# EAGLE design PCB - BOARD (EAGLE 9.2.2)

## Sheet 1 of 8: Connectors for module board
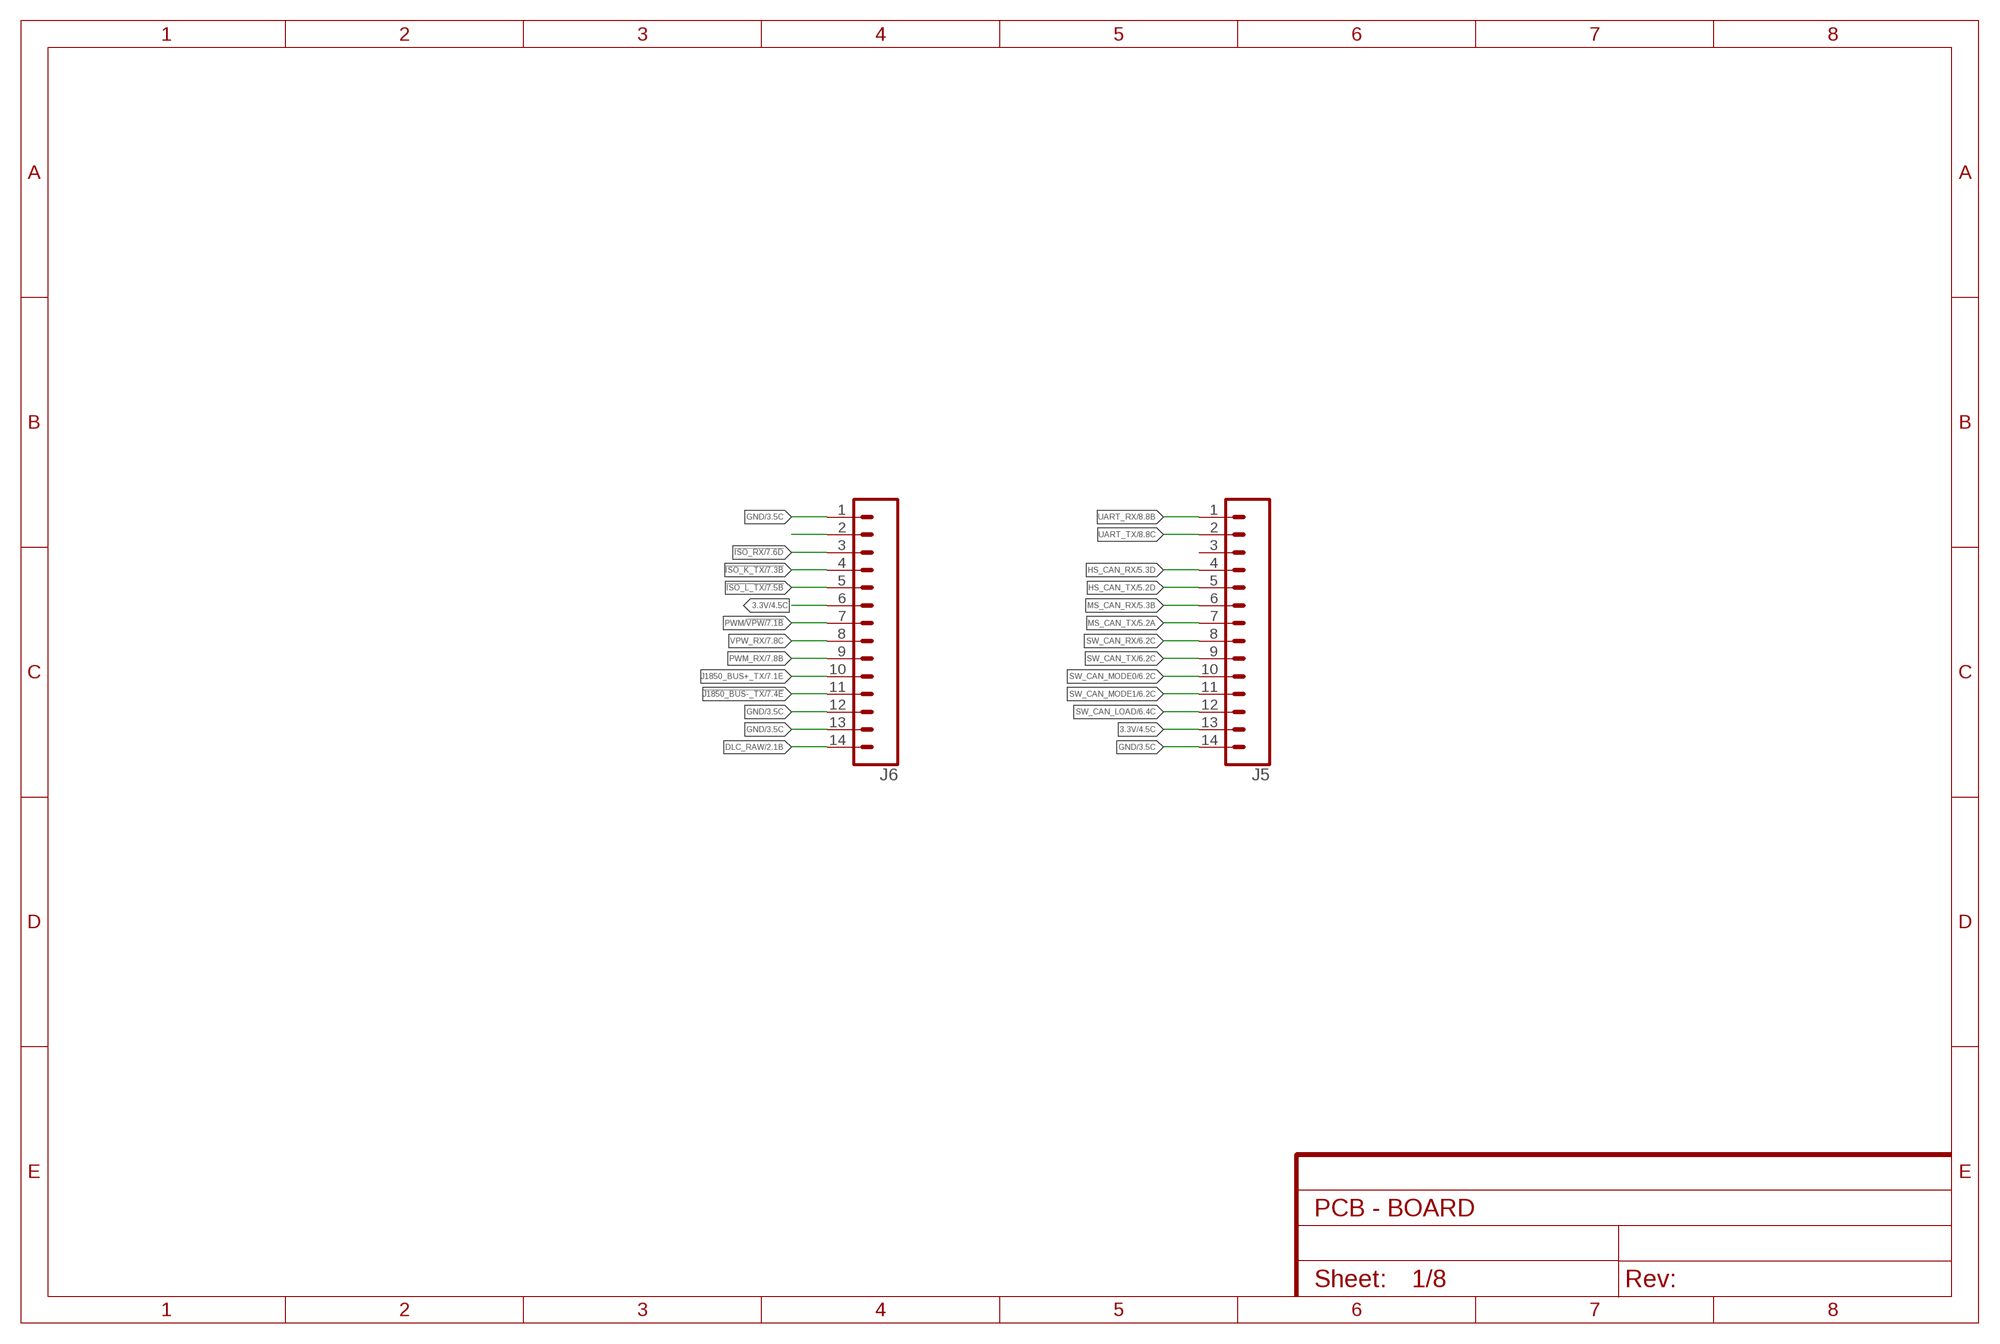
[diagram p0: schematic, sheet 1]

### Parts
J5  CONN_14  [1X14]
J6  CONN_14  [1X14]

### Nets
3.3V: J5.13 J6.6 ; also sheet 2,4,5,6,7
!ISO_K_TX: J6.4 ; also sheet 7
!ISO_L_TX: J6.5 ; also sheet 7
!ISO_RX: J6.3 ; also sheet 7
!J1850_BUS-_TX: J6.11 ; also sheet 7
DLC_RAW: J6.14 ; also sheet 2,3
GND: J5.14 J6.1 J6.2 J6.12 J6.13 ; also sheet 2,3,4,5,6,7,8
HS_CAN_RX: J5.4 ; also sheet 5
HS_CAN_TX: J5.5 ; also sheet 5
J1850_BUS+_TX: J6.10 ; also sheet 7
MS_CAN_RX: J5.6 ; also sheet 5
MS_CAN_TX: J5.7 ; also sheet 5
PWM/!VPW: J6.7 ; also sheet 7
PWM_RX: J6.9 ; also sheet 7
SW_CAN_LOAD: J5.12 ; also sheet 6
SW_CAN_MODE0: J5.10 ; also sheet 6
SW_CAN_MODE1: J5.11 ; also sheet 6
SW_CAN_RX: J5.8 ; also sheet 6
SW_CAN_TX: J5.9 ; also sheet 6
UART_RX: J5.1 ; also sheet 8
UART_TX: J5.2 ; also sheet 8
VPW_RX: J6.8 ; also sheet 7
Unconnected: J5.3

## Sheet 2 of 8: Power section
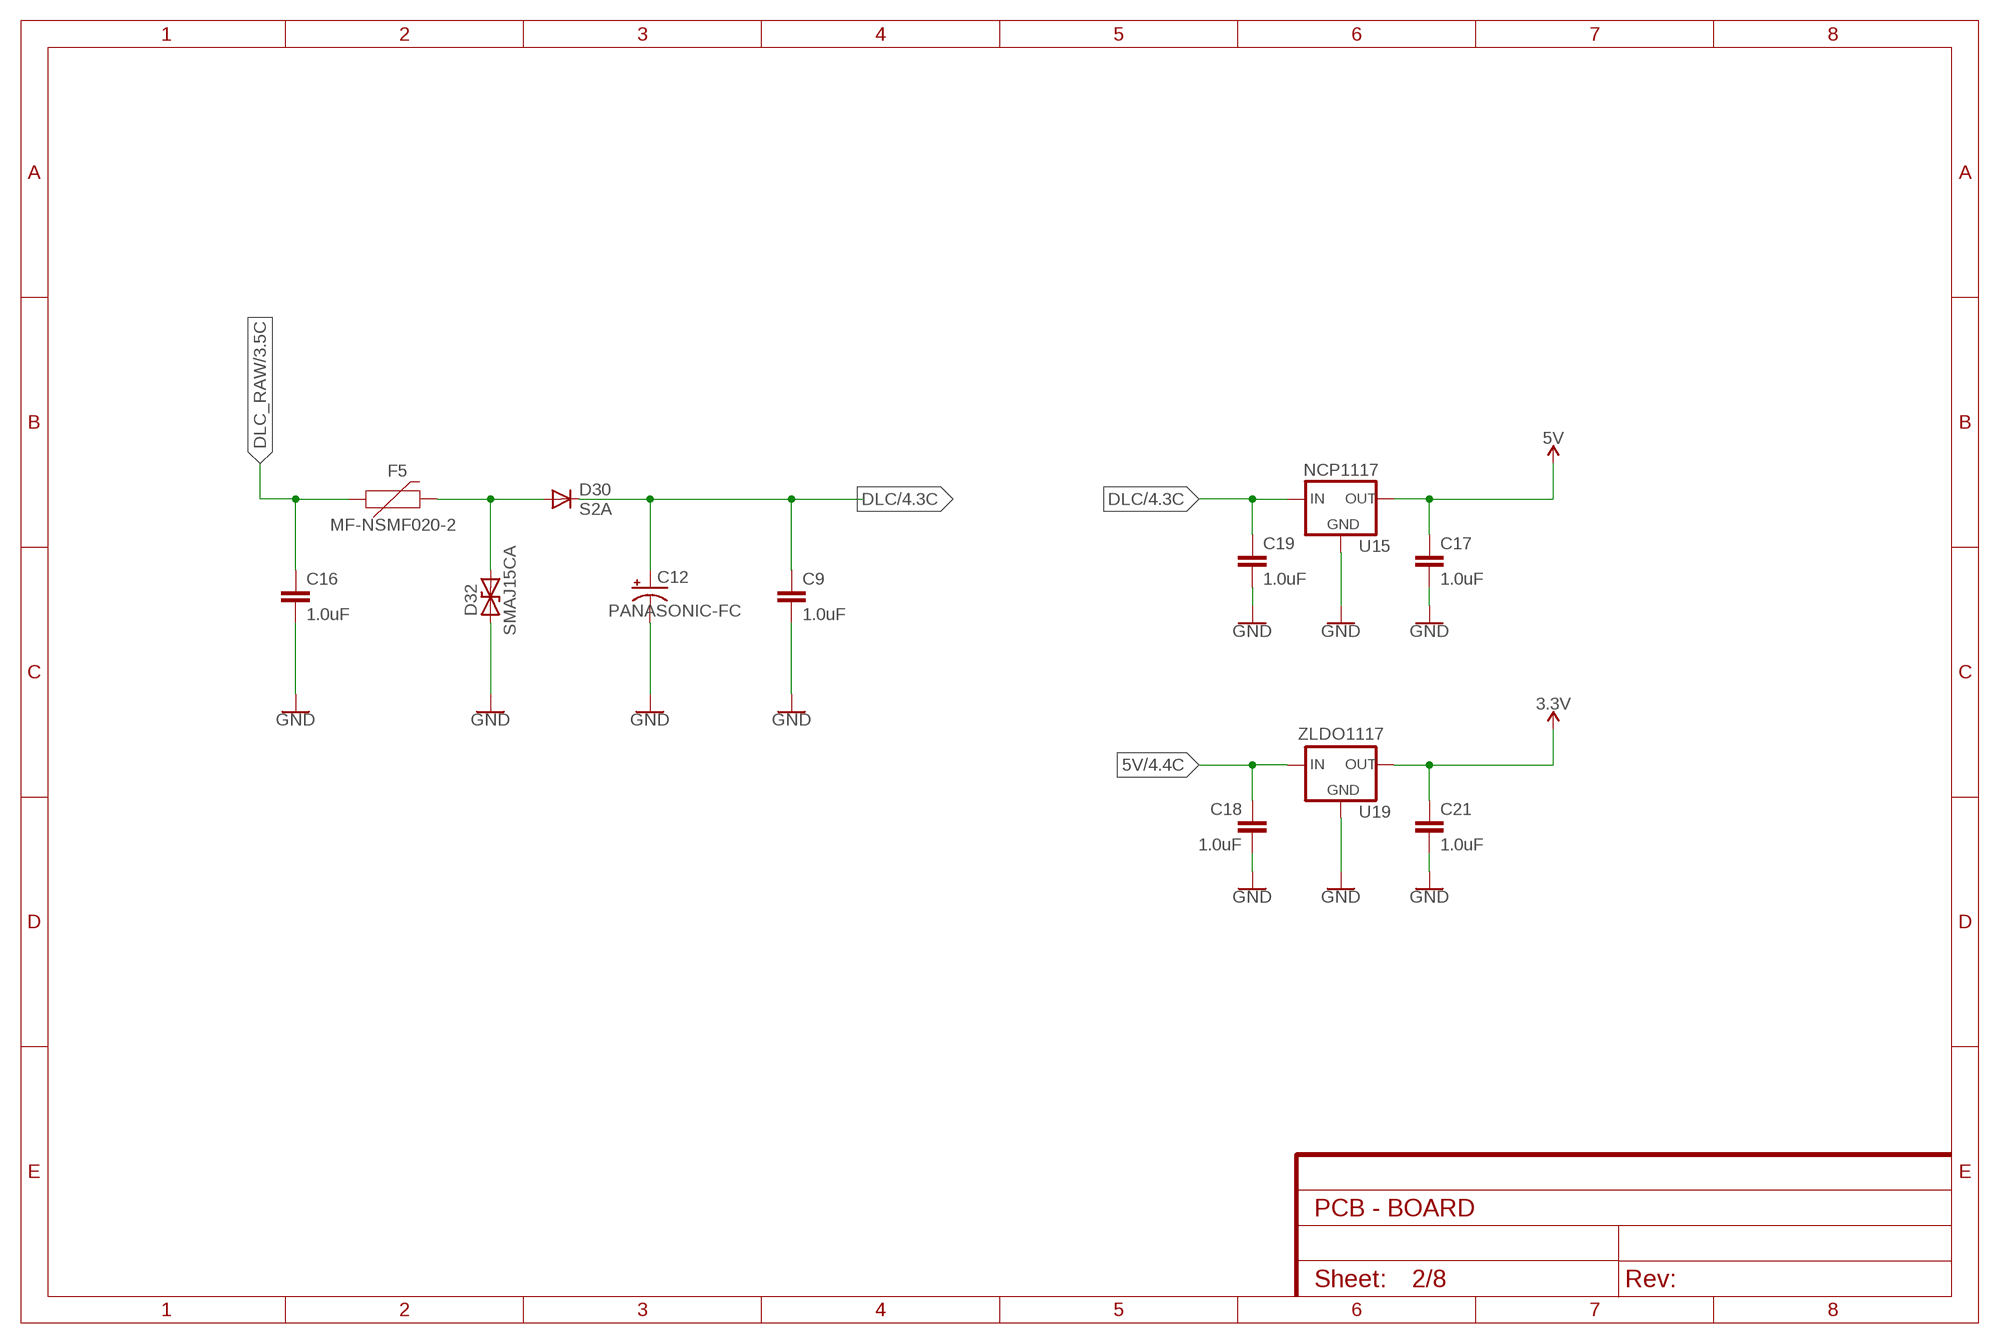
[diagram p1: schematic, sheet 2]

### Parts
C9  1.0uF  1.0UF-0805-25V-(+80/-20%)  [0805]
C12  PANASONIC-FC  [5X11]
C16  1.0uF  1.0UF-0805-25V-(+80/-20%)  [0805]
C17  1.0uF  1.0UF-0805-25V-(+80/-20%)  [0805]
C18  1.0uF  1.0UF-0805-25V-(+80/-20%)  [0805]
C19  1.0uF  1.0UF-0805-25V-(+80/-20%)  [0805]
C21  1.0uF  1.0UF-0805-25V-(+80/-20%)  [0805]
D30  S2A  [DO214AA]
D32  SMAJ15CA  [DO214AC]
F5  MF-NSMF020-2  PPTC_THREE-QUARTER-AMP  [1206]
U15  NCP1117  NCP1117DPAK  [TO-252]
U19  ZLDO1117  ZLDO1117SOT223  [SOT223]

### Nets
3.3V: C21.1 U19.2(OUT) U19.4(OUT) ; also sheet 1,4,5,6,7
5V: C17.1 C18.1 U15.2(OUT) U19.3(IN) ; also sheet 4,5,7
DLC: C9.1 C12.2(+) C19.1 D30.C U15.3(IN) ; also sheet 4,6,7
DLC_RAW: C16.1 F5.1 ; also sheet 1,3
DLC_RAW2: D30.A D32.C F5.2
GND: C9.2 C12.1(-) C16.2 C17.2 C18.2 C19.2 C21.2 D32.A U15.1(GND) U19.1(GND) ; also sheet 1,3,4,5,6,7,8

## Sheet 3 of 8: PCB and OBD connector
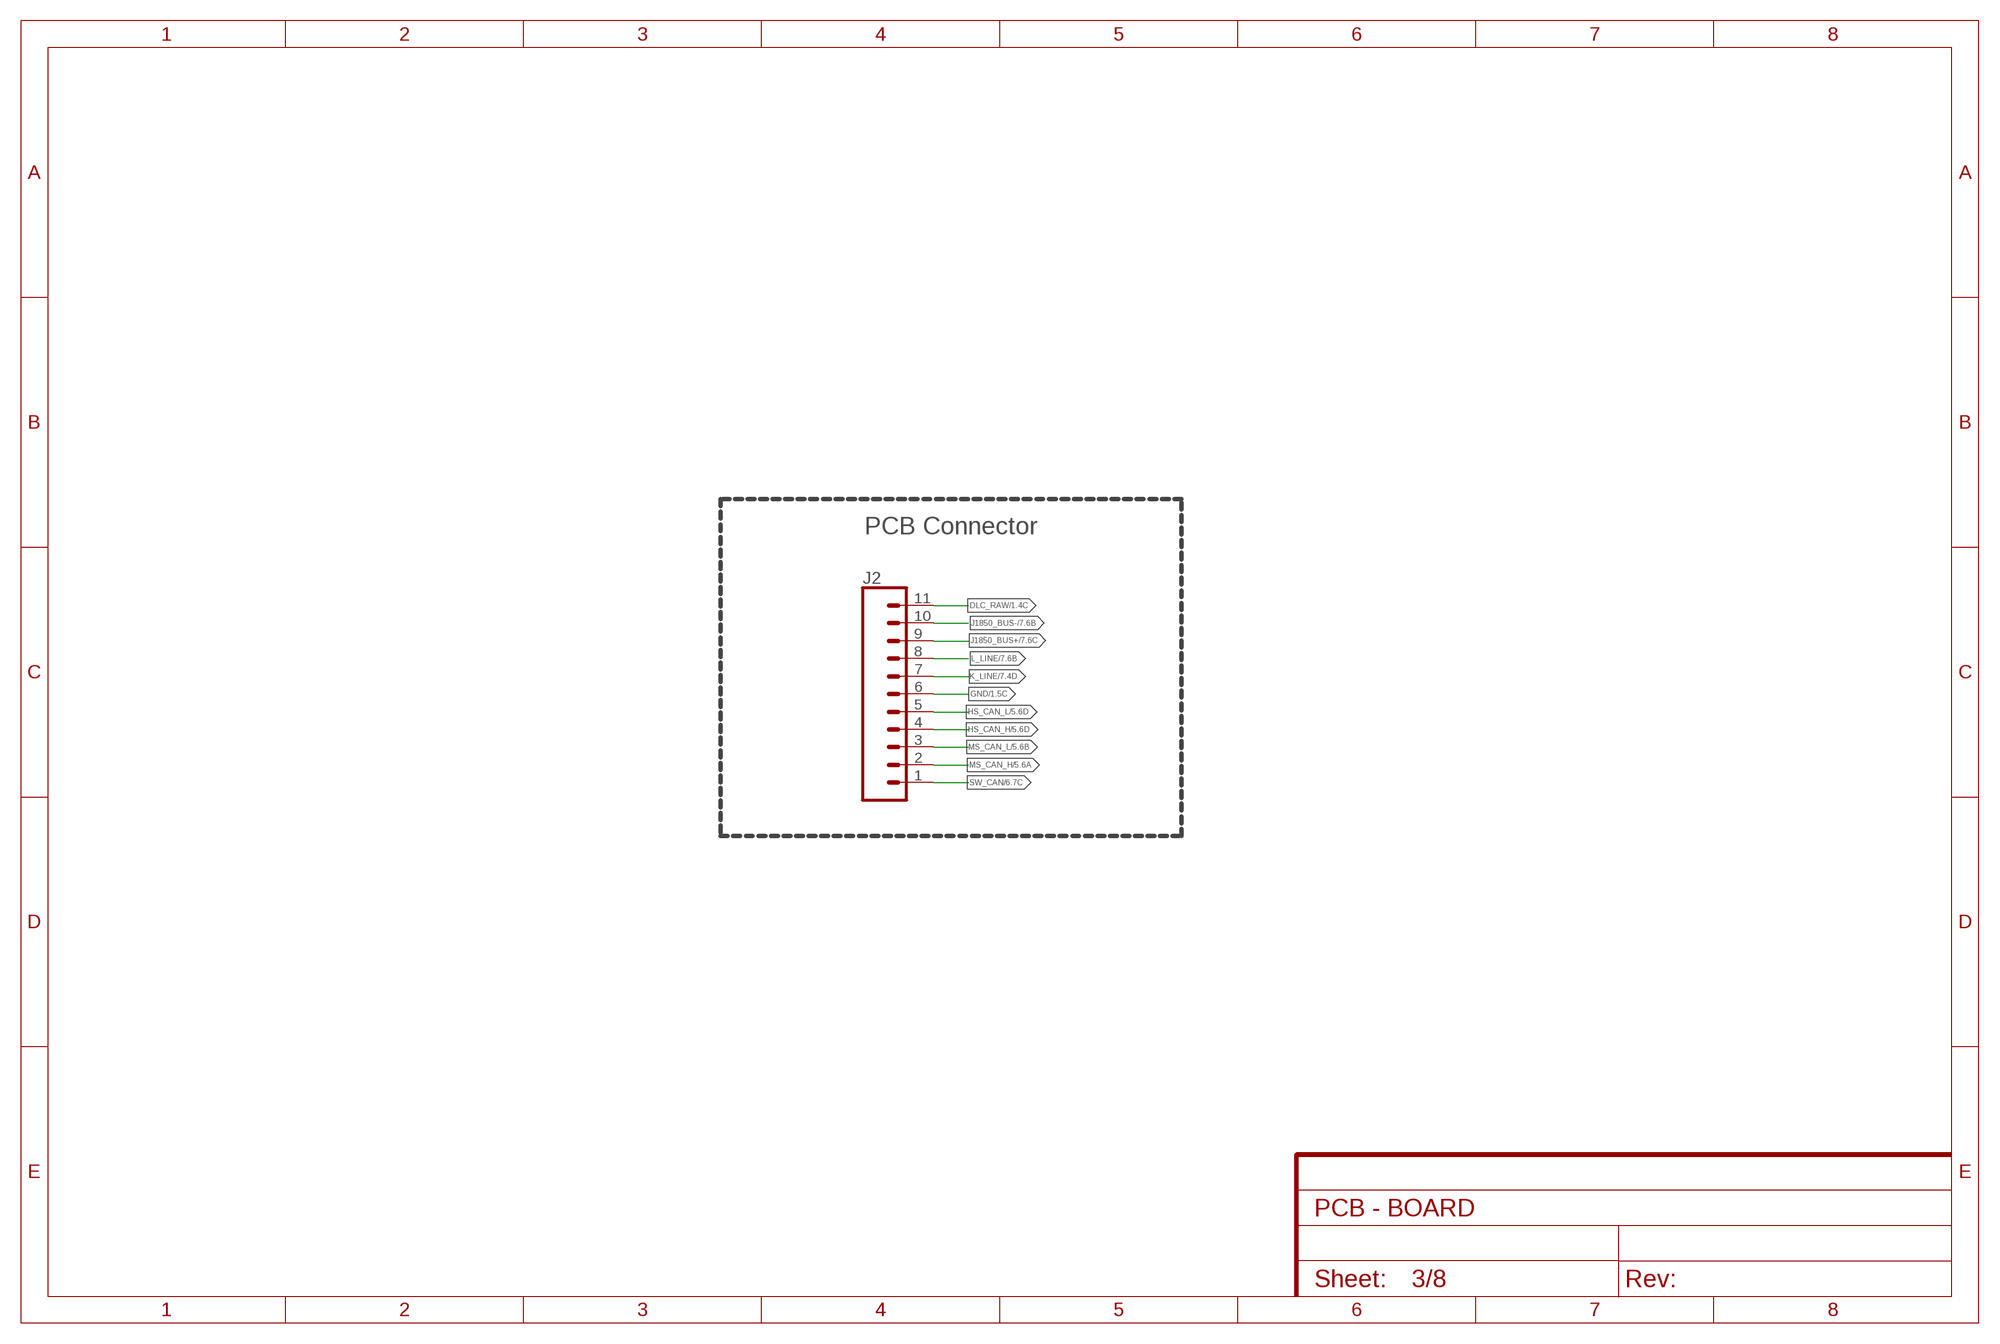
[diagram p2: schematic, sheet 3]

### Parts
J2  CONN_11  [1X11]

### Nets
DLC_RAW: J2.11 ; also sheet 1,2
GND: J2.6 ; also sheet 1,2,4,5,6,7,8
HS_CAN_H: J2.4 ; also sheet 5
HS_CAN_L: J2.5 ; also sheet 5
J1850_BUS+: J2.9 ; also sheet 7
J1850_BUS-: J2.10 ; also sheet 7
K_LINE: J2.7 ; also sheet 7
L_LINE: J2.8 ; also sheet 7
MS_CAN_H: J2.2 ; also sheet 5
MS_CAN_L: J2.3 ; also sheet 5
SW_CAN: J2.1 ; also sheet 6

### Notes on the sheet
- PCB Connector

## Sheet 4 of 8: LED's
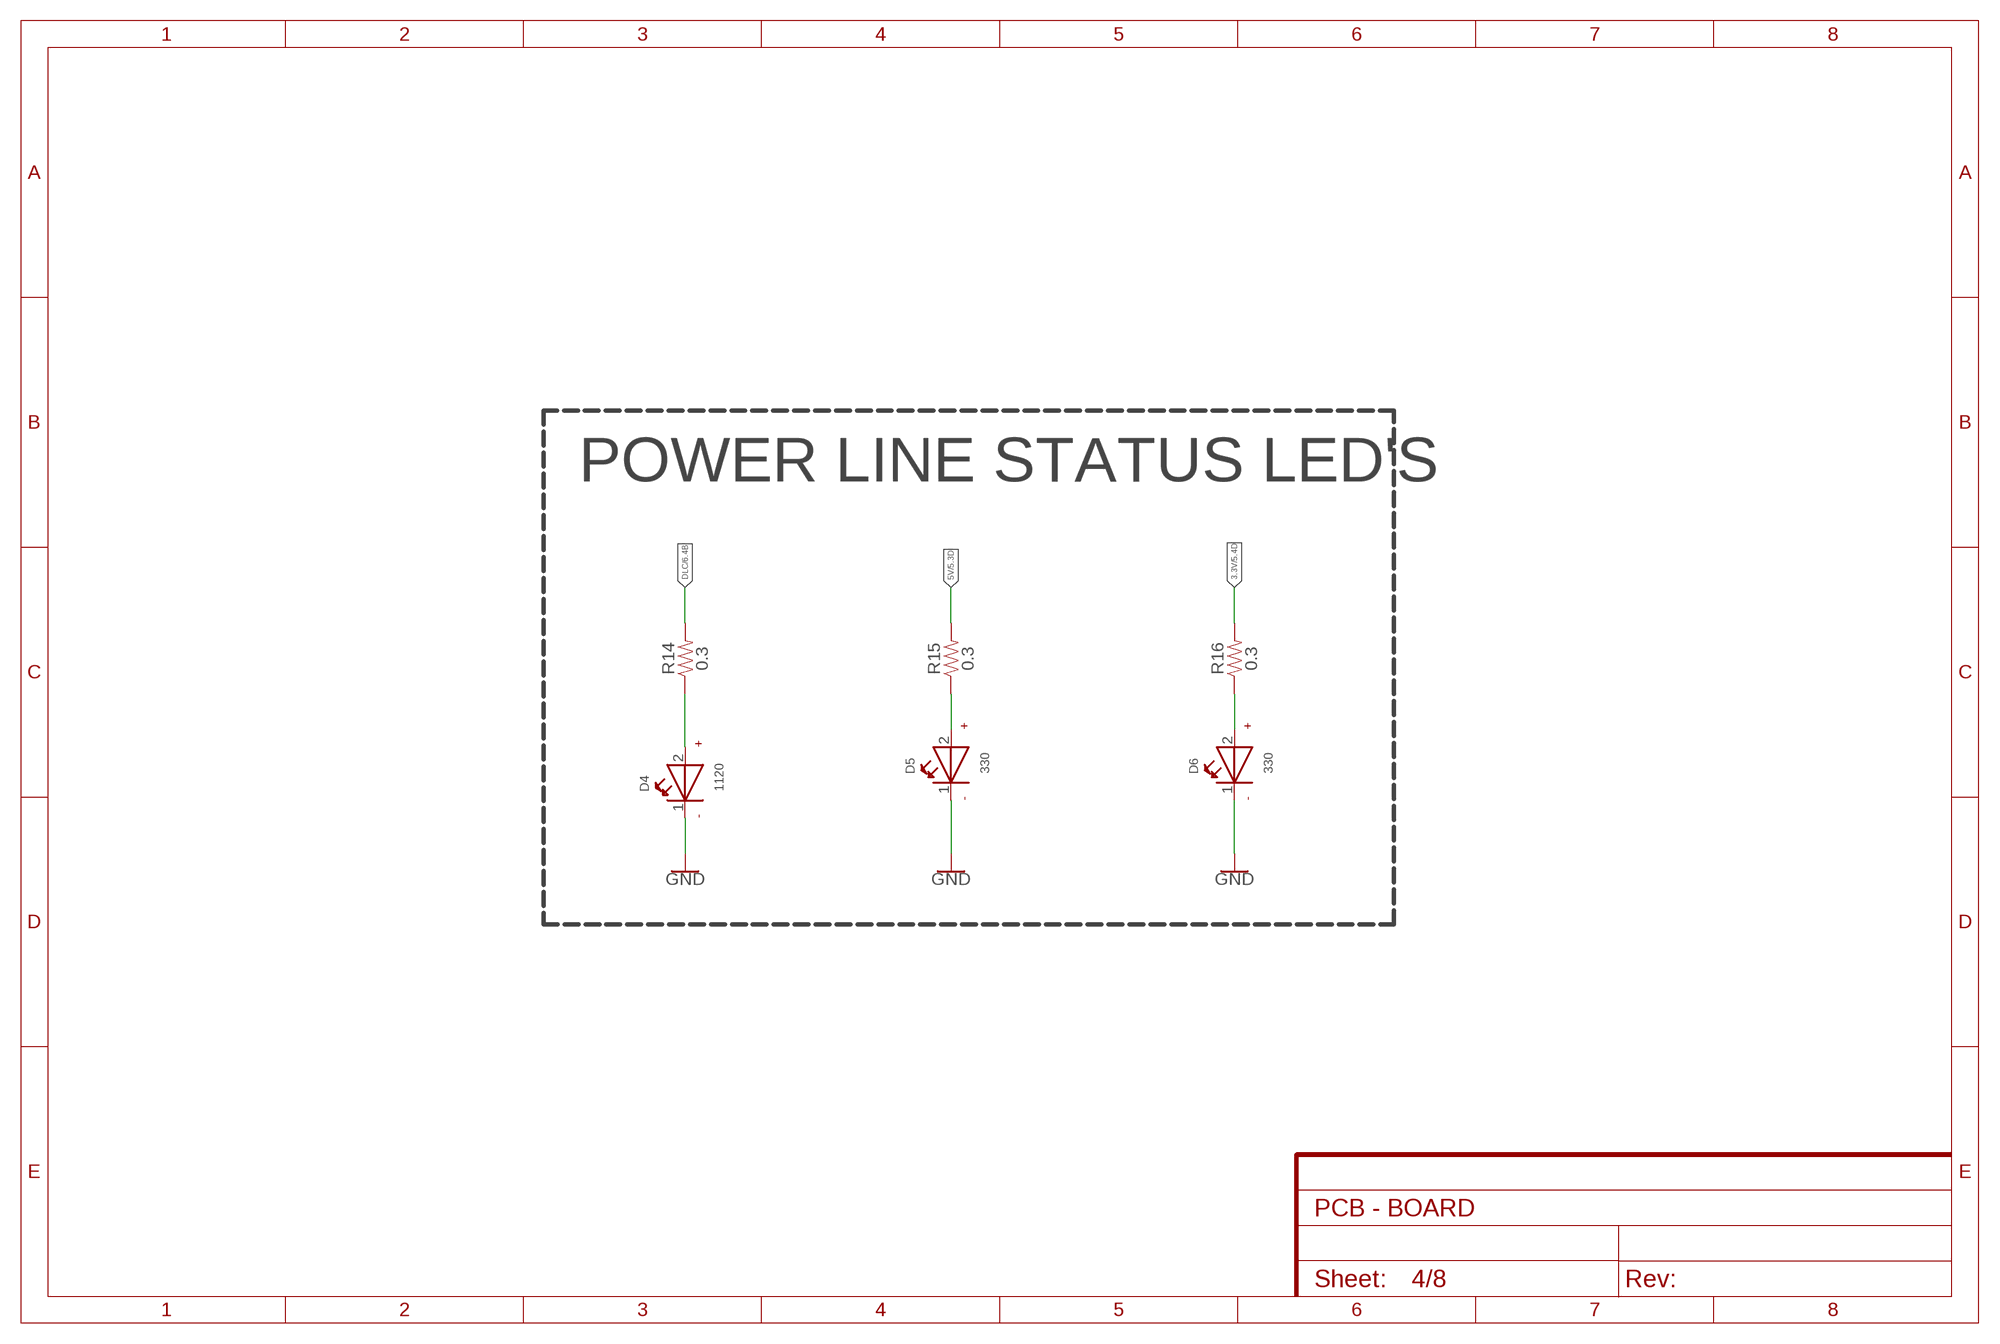
[diagram p3: schematic, sheet 4]

### Parts
D4  1120  WL-SMCW-150120BS75000-B  [WL-SMCW_1206]
D5  330  WL-SMCW-150120BS75000-B  [WL-SMCW_1206]
D6  330  WL-SMCW-150120BS75000-B  [WL-SMCW_1206]
R14  0.3  0.3OHM-0805-1/8W-1%  [0805]
R15  0.3  0.3OHM-0805-1/8W-1%  [0805]
R16  0.3  0.3OHM-0805-1/8W-1%  [0805]

### Nets
3.3V: R16.2 ; also sheet 1,2,5,6,7
5V: R15.2 ; also sheet 2,5,7
DLC: R14.2 ; also sheet 2,6,7
GND: D4.1(-) D5.1(-) D6.1(-) ; also sheet 1,2,3,5,6,7,8
N$29: D6.2(+) R16.1
N$30: D5.2(+) R15.1
N$32: D4.2(+) R14.1

### Notes on the sheet
- POWER LINE STATUS LED'S

## Sheet 5 of 8: CAN transceivers
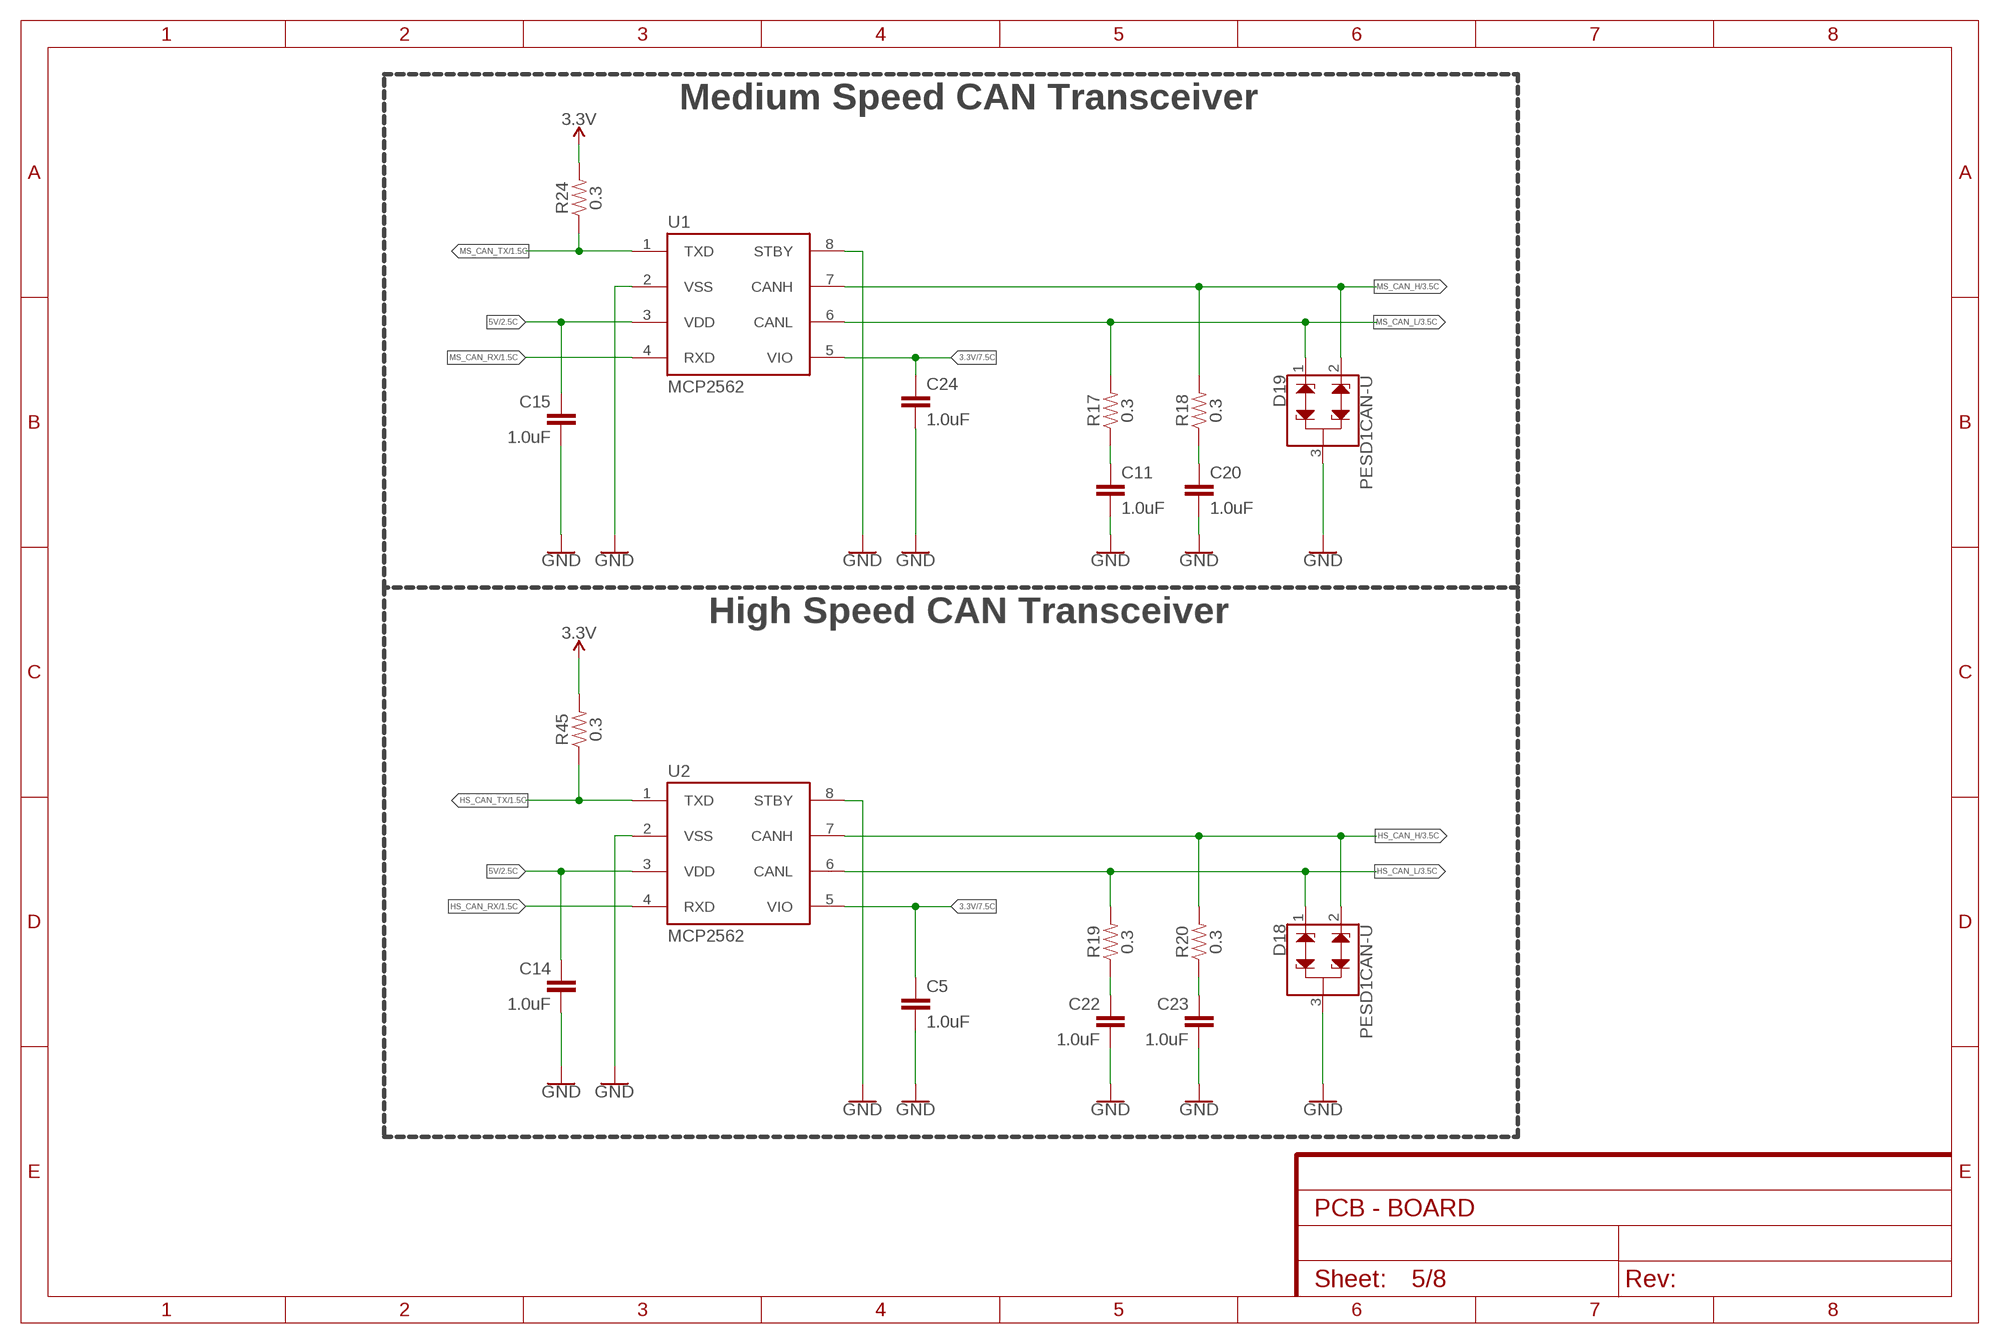
[diagram p4: schematic, sheet 5]

### Parts
C5  1.0uF  1.0UF-0805-25V-(+80/-20%)  [0805]
C11  1.0uF  1.0UF-0805-25V-(+80/-20%)  [0805]
C14  1.0uF  1.0UF-0805-25V-(+80/-20%)  [0805]
C15  1.0uF  1.0UF-0805-25V-(+80/-20%)  [0805]
C20  1.0uF  1.0UF-0805-25V-(+80/-20%)  [0805]
C22  1.0uF  1.0UF-0805-25V-(+80/-20%)  [0805]
C23  1.0uF  1.0UF-0805-25V-(+80/-20%)  [0805]
C24  1.0uF  1.0UF-0805-25V-(+80/-20%)  [0805]
D18  PESD1CAN-U  [SOT323]
D19  PESD1CAN-U  [SOT323]
R17  0.3  0.3OHM-0805-1/8W-1%  [0805]
R18  0.3  0.3OHM-0805-1/8W-1%  [0805]
R19  0.3  0.3OHM-0805-1/8W-1%  [0805]
R20  0.3  0.3OHM-0805-1/8W-1%  [0805]
R24  0.3  0.3OHM-0805-1/8W-1%  [0805]
R45  0.3  0.3OHM-0805-1/8W-1%  [0805]
U1  MCP2562  [SOIC-8]
U2  MCP2562  [SOIC-8]

### Nets
3.3V: C5.1 C24.1 R24.2 R45.2 U1.5(VIO) U2.5(VIO) ; also sheet 1,2,4,6,7
5V: C14.1 C15.1 U1.3(VDD) U2.3(VDD) ; also sheet 2,4,7
GND: C5.2 C11.2 C14.2 C15.2 C20.2 C22.2 C23.2 C24.2 D18.3 D19.3 U1.2(VSS) U1.8(STBY) U2.2(VSS) U2.8(STBY) ; also sheet 1,2,3,4,6,7,8
HS_CAN_H: D18.2 R20.2 U2.7(CANH) ; also sheet 3
HS_CAN_L: D18.1 R19.2 U2.6(CANL) ; also sheet 3
HS_CAN_RX: U2.4(RXD) ; also sheet 1
HS_CAN_TX: R45.1 U2.1(TXD) ; also sheet 1
MS_CAN_H: D19.2 R18.2 U1.7(CANH) ; also sheet 3
MS_CAN_L: D19.1 R17.2 U1.6(CANL) ; also sheet 3
MS_CAN_RX: U1.4(RXD) ; also sheet 1
MS_CAN_TX: R24.1 U1.1(TXD) ; also sheet 1
N$17: C11.1 R17.1
N$25: C20.1 R18.1
N$26: C22.1 R19.1
N$27: C23.1 R20.1

### Notes on the sheet
- Medium Speed CAN Transceiver
- High Speed CAN Transceiver

## Sheet 6 of 8: Single Wire CAN Transceiver
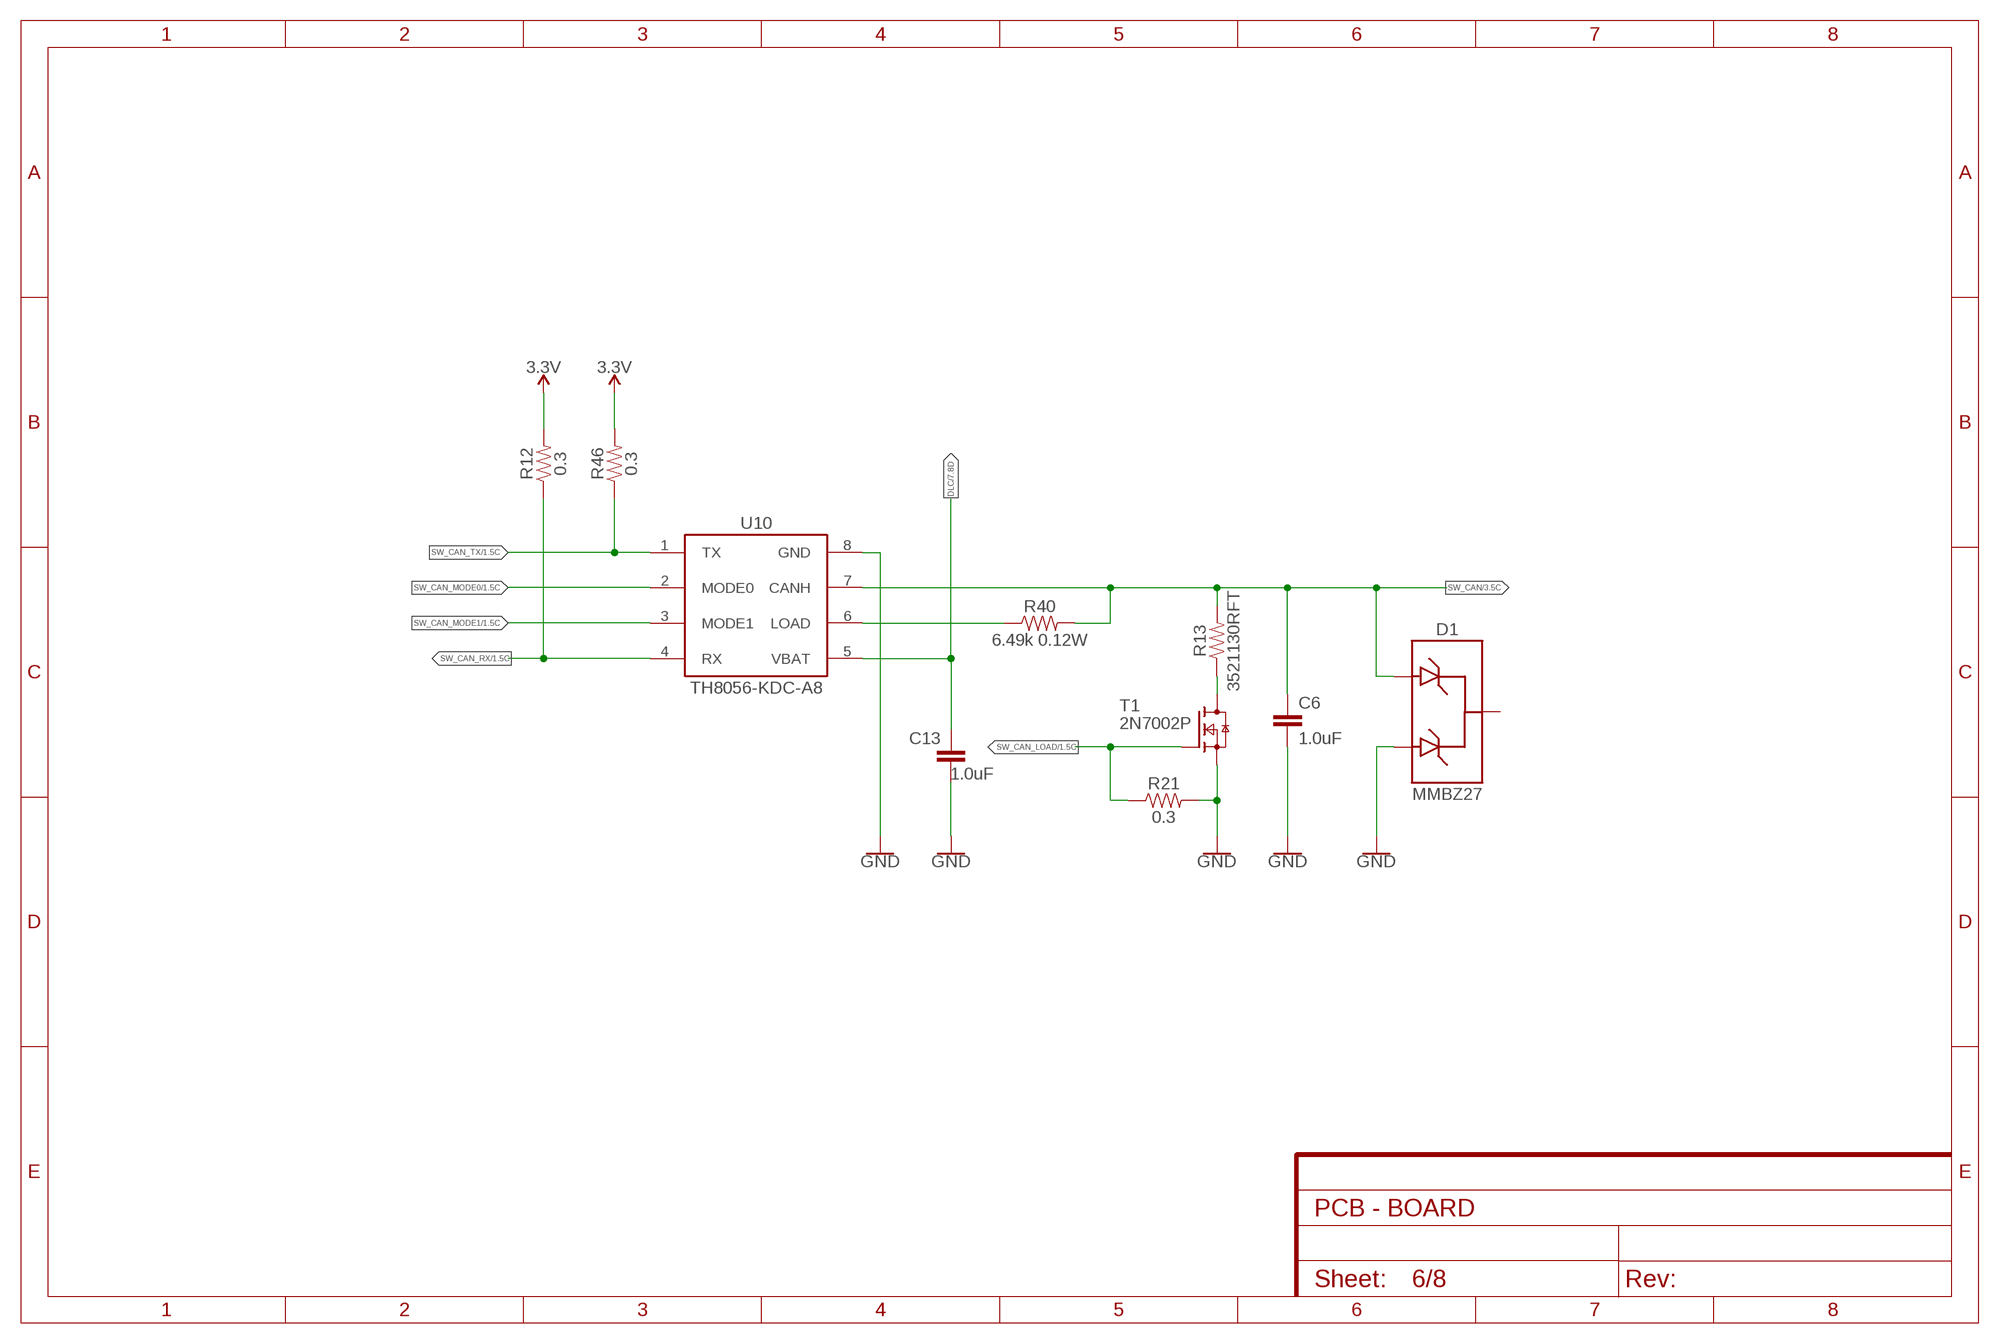
[diagram p5: schematic, sheet 6]

### Parts
C6  1.0uF  1.0UF-0805-25V-(+80/-20%)  [0805]
C13  1.0uF  1.0UF-0805-25V-(+80/-20%)  [0805]
D1  MMBZ27  [SOT23-3]
R12  0.3  0.3OHM-0805-1/8W-1%  [0805]
R13  3521130RFT  [3521]
R21  0.3  0.3OHM-0805-1/8W-1%  [0805]
R40  6.49k 0.12W  10OHM-1206-1/4W-1%  [1206]
R46  0.3  0.3OHM-0805-1/8W-1%  [0805]
T1  2N7002P  [SOT23]
U10  TH8056-KDC-A8  [SOIC-8]

### Nets
3.3V: R12.2 R46.2 ; also sheet 1,2,4,5,7
DLC: C13.1 U10.5(VBAT) ; also sheet 2,4,7
GND: C6.2 C13.2 D1.2(A2) R21.2 T1.2(S) U10.8(GND) ; also sheet 1,2,3,4,5,7,8
LOAD: R40.1 U10.6(LOAD)
N$13: R13.1 T1.3(D)
SW_CAN: C6.1 D1.1(A1) R13.2 R40.2 U10.7(CANH) ; also sheet 3
SW_CAN_LOAD: R21.1 T1.1(G) ; also sheet 1
SW_CAN_MODE0: U10.2(MODE0) ; also sheet 1
SW_CAN_MODE1: U10.3(MODE1) ; also sheet 1
SW_CAN_RX: R12.1 U10.4(RX) ; also sheet 1
SW_CAN_TX: R46.1 U10.1(TX) ; also sheet 1
Unconnected: D1.3(C)

## Sheet 7 of 8: ISO9141/ISO14230 and J1850 transceiver
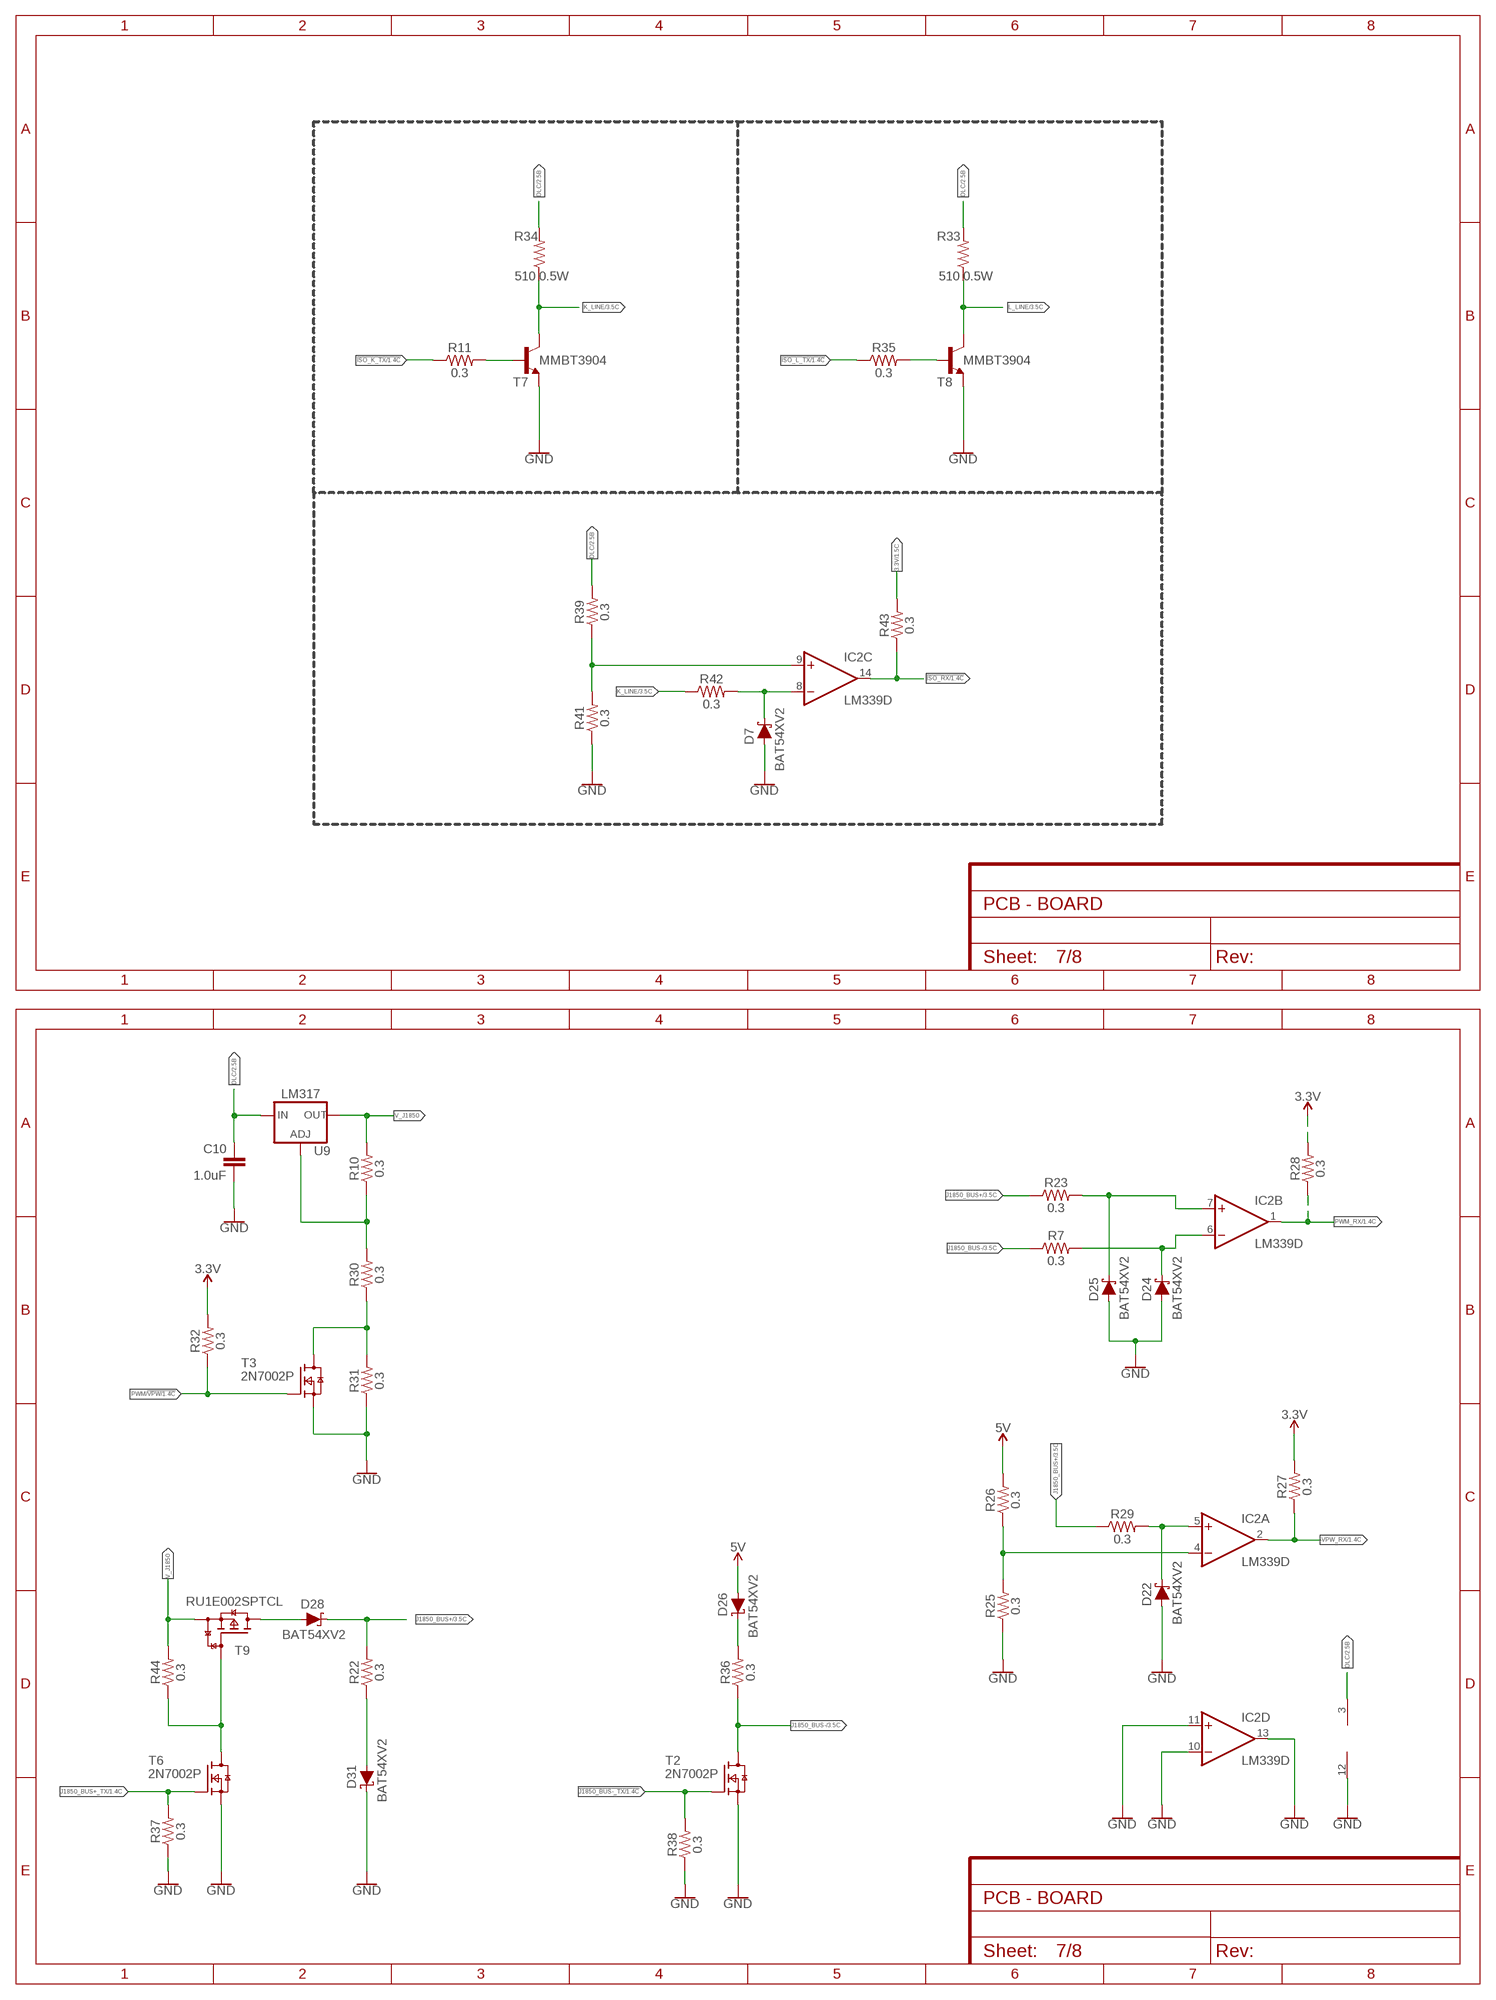
[diagram p6: schematic, sheet 7]

### Parts
C10  1.0uF  1.0UF-0805-25V-(+80/-20%)  [0805]
D7  BAT54XV2  [SOD-523F]
D22  BAT54XV2  [SOD-523F]
D24  BAT54XV2  [SOD-523F]
D25  BAT54XV2  [SOD-523F]
D26  BAT54XV2  [SOD-523F]
D28  BAT54XV2  [SOD-523F]
D31  BAT54XV2  [SOD-523F]
IC2  LM339D  [SO14]
R7  0.3  0.3OHM-0805-1/8W-1%  [0805]
R10  0.3  0.3OHM-0805-1/8W-1%  [0805]
R11  0.3  0.3OHM-0805-1/8W-1%  [0805]
R22  0.3  0.3OHM-0805-1/8W-1%  [0805]
R23  0.3  0.3OHM-0805-1/8W-1%  [0805]
R25  0.3  0.3OHM-0805-1/8W-1%  [0805]
R26  0.3  0.3OHM-0805-1/8W-1%  [0805]
R27  0.3  0.3OHM-0805-1/8W-1%  [0805]
R28  0.3  0.3OHM-0805-1/8W-1%  [0805]
R29  0.3  0.3OHM-0805-1/8W-1%  [0805]
R30  0.3  0.3OHM-0805-1/8W-1%  [0805]
R31  0.3  0.3OHM-0805-1/8W-1%  [0805]
R32  0.3  0.3OHM-0805-1/8W-1%  [0805]
R33  510 0.5W  0.1OHM-1210-1/2W-1%  [1210]
R34  510 0.5W  0.1OHM-1210-1/2W-1%  [1210]
R35  0.3  0.3OHM-0805-1/8W-1%  [0805]
R36  0.3  0.3OHM-0805-1/8W-1%  [0805]
R37  0.3  0.3OHM-0805-1/8W-1%  [0805]
R38  0.3  0.3OHM-0805-1/8W-1%  [0805]
R39  0.3  0.3OHM-0805-1/8W-1%  [0805]
R41  0.3  0.3OHM-0805-1/8W-1%  [0805]
R42  0.3  0.3OHM-0805-1/8W-1%  [0805]
R43  0.3  0.3OHM-0805-1/8W-1%  [0805]
R44  0.3  0.3OHM-0805-1/8W-1%  [0805]
T2  2N7002P  [SOT23]
T3  2N7002P  [SOT23]
T6  2N7002P  [SOT23]
T7  MMBT3904  MMBT3904LT1-NPN-SOT23-BEC  [SOT23-BEC]
T8  MMBT3904  MMBT3904LT1-NPN-SOT23-BEC  [SOT23-BEC]
T9  RU1E002SPTCL  BSS84AKW  [SOT323]
U9  LM317  V_REG_317SMD  [SOT223]

### Nets
3.3V: R27.2 R28.2 R32.2 R43.2 ; also sheet 1,2,4,5,6
5V: D26.A R26.2 ; also sheet 2,4,5
!ISO_K_TX: R11.1 ; also sheet 1
!ISO_L_TX: R35.1 ; also sheet 1
!ISO_RX: IC2.14(C:OUT) R43.1 ; also sheet 1
!J1850_BUS-_TX: R38.2 T2.1(G) ; also sheet 1
ADJ: R10.1 R30.2 U9.1(ADJ)
COMPARATOR+: D22.C IC2.5(A:+IN) R29.2
COMPARATOR-: IC2.4(A:-IN) R25.2 R26.1
DLC: C10.1 IC2.3(P:V+) R33.2 R34.2 R39.2 U9.3(IN) ; also sheet 2,4,6
GND: C10.2 D7.A D22.A D24.A D25.A D31.C IC2.10(D:-IN) IC2.11(D:+IN) IC2.12(P:GND) IC2.13(D:OUT) R25.1 R31.1 R37.1 R38.1 R41.1 T2.2(S) T3.2(S) T6.2(S) T7.E T8.E ; also sheet 1,2,3,4,5,6,8
J1850_BUS+: D25.C D28.C IC2.7(B:+IN) R22.2 R23.1 R23.2 R29.1 ; also sheet 3
J1850_BUS+_TX: R37.2 T6.1(G) ; also sheet 1
J1850_BUS-: D24.C IC2.6(B:-IN) R7.1 R7.2 R36.1 T2.3(D) ; also sheet 3
K-LINE: D7.C IC2.8(C:-IN) R42.2
K_LINE: R34.1 R42.1 T7.C ; also sheet 3
L_LINE: R33.1 T8.C ; also sheet 3
N$1: R44.1 T6.3(D) T9.1(G)
N$5: D26.C R36.2
N$8: IC2.9(C:+IN) R39.1 R41.2
N$9: D28.A T9.3(D)
N$11: D31.A R22.1
N$12: R35.2 T8.B
N$14: R11.2 T7.B
N$15: R30.1 R31.2 T3.3(D)
PWM/!VPW: R32.1 T3.1(G) ; also sheet 1
PWM_RX: IC2.1(B:OUT) R28.1 ; also sheet 1
V_J1850: R10.2 R44.2 T9.2(S) U9.2(OUT) U9.4(OUT)
VPW_RX: IC2.2(A:OUT) R27.1 ; also sheet 1

## Sheet 8 of 8: USB to UART bridge
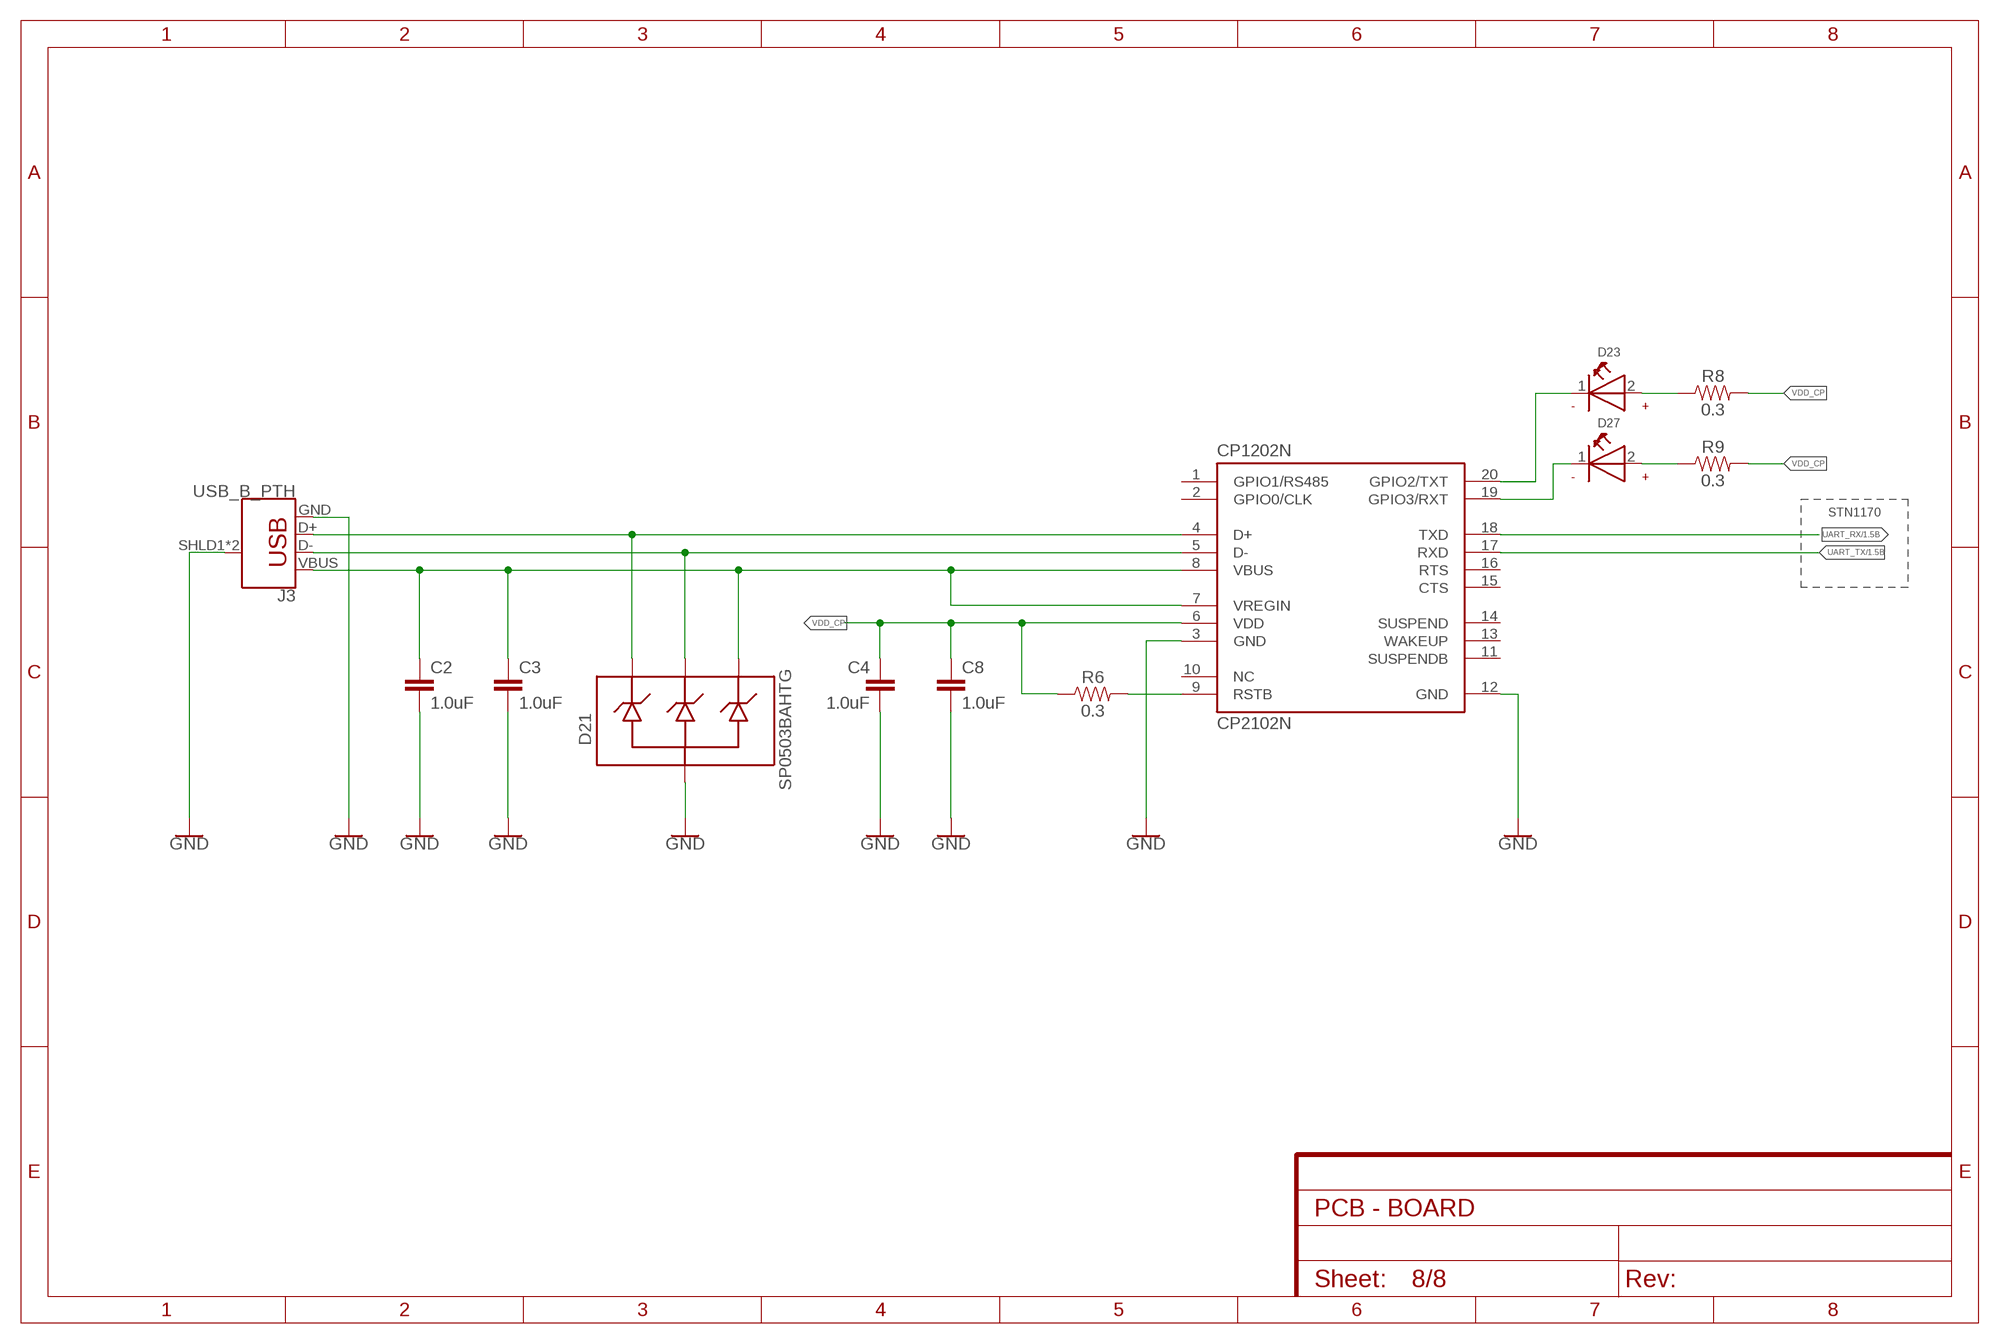
[diagram p7: schematic, sheet 8]

### Parts
C2  1.0uF  1.0UF-0805-25V-(+80/-20%)  [0805]
C3  1.0uF  1.0UF-0805-25V-(+80/-20%)  [0805]
C4  1.0uF  1.0UF-0805-25V-(+80/-20%)  [0805]
C8  1.0uF  1.0UF-0805-25V-(+80/-20%)  [0805]
CP1202N  CP2102N  [QFN20]
D21  SP0503BAHTG  [SOT143-4]
D23  WL-SMCW-150120BS75000-B  [WL-SMCW_1206]
D27  WL-SMCW-150120BS75000-B  [WL-SMCW_1206]
J3  USB_B_PTH  [USB-B-PTH]
R6  0.3  0.3OHM-0805-1/8W-1%  [0805]
R8  0.3  0.3OHM-0805-1/8W-1%  [0805]
R9  0.3  0.3OHM-0805-1/8W-1%  [0805]

### Nets
D+: CP1202N.4(D+) D21.4 J3.D+
D-: CP1202N.5(D-) D21.3 J3.D-
GND: C2.2 C3.2 C4.2 C8.2 CP1202N.3(GND) CP1202N.12(GND) D21.1 J3.GND J3.SHLD1(SHIELD) J3.SHLD2(SHIELD) ; also sheet 1,2,3,4,5,6,7
N$71: CP1202N.9(RSTB) R6.2
N$72: CP1202N.20(GPIO2/TXT) D23.1(-)
N$73: CP1202N.19(GPIO3/RXT) D27.1(-)
N$74: D23.2(+) R8.1
N$75: D27.2(+) R9.1
UART_RX: CP1202N.18(TXD) ; also sheet 1
UART_TX: CP1202N.17(RXD) ; also sheet 1
VBUS: C2.1 C3.1 CP1202N.7(VREGIN) CP1202N.8(VBUS) D21.2 J3.VBUS
VDD_CP: C4.1 C8.1 CP1202N.6(VDD) R6.1 R8.2 R9.2
Unconnected: CP1202N.1(GPIO1/RS485) CP1202N.2(GPIO0/CLK) CP1202N.10(NC) CP1202N.11(SUSPENDB) CP1202N.13(WAKEUP) CP1202N.14(SUSPEND) CP1202N.15(CTS) CP1202N.16(RTS)

### Notes on the sheet
- STN1170

## Library data of the parts
C2-C6 C8-C11 C13-C24 = SparkFun-Capacitors:1.0UF: 1µF ceramic capacitors A capacitor is a passive two-terminal electrical component used to store electrical energy temporarily in an electric field.; PROD_ID: CAP-11625
C12 = Goodies:PANASONIC-FC: PANASONIC Aluminum Electrolytic Capacitors (Radial Lead Type) Radial Lead Type Series: FC Type: A
CP1202N = prywatne:CP2102N: The CP2102N devices, part of the USBXpress family, are designed to quickly add USB to your applications by eliminating firmware complexity and reducing development time.
D1 = prywatne:MMBZ27: MMBZ27VCLT1G/T3G 40 Watt Peak Power Zener Transient Voltage Suppressors SOT−23 Dual Common Cathode Zeners for ESD Protection The SZ/MMBZ27VCL is recommended by theSociety of Automotive Engineers (SAE), February 2000, J2411“Single Wire Can Network for Vehicle Applications” specification as a solution for transient voltage problems.
D4-D6 D23 D27 = EAGLE-COLOR_LED-rev17b:WL-SMCW: SMD mono-color Chip LED Characteristics Low energy consumption High reliability Low current requirement Fast switching No UV/IR radiation Smallest SMD package with exceptional brightness Top view Wide viewing angle PBC high-usage Applications Backlight for mobile and portable device keypads Indoor and outdoor message boards Flat backlight for LCDs, switches and symbols Display for industrial control systems and traffic Miniaturized color effects Pedestrian mark Optical indicators General lighting Toys <http://katalog.we-online.de/media/images/eipal/WL-SMCW_pf2.jpg> Details see: http://katalog.we-online.de/en/led/WL-SMCW?m Updated 2015-04-10 2015 (C) Wurth Elektronik
D7 D22 D24-D26 D28 D31 = prywatne:BAT54XV2
D18 D19 = Goodies:PESD1CAN-U: PESD1CAN-U bus ESD General description ElectroStatic Discharge (ESD) protection diode in a very small SOT323 (SC-70 ) Surface-Mounted Device (SMD) plastic package designed to protect two automotive Controller Area Network (CAN) bus lines from the damage caused by ESD and other transients.
D21 = prywatne:SP0503BAHTG
D30 = s2x_10:S2*: S2A - S2M General Purpose Rectifiers Source: http://www.fairchildsemi.com/datasheets/S2/S2A.pdf; MF: Fairchild; MPN: S2A; OC_FARNELL: 1467485; OC_NEWARK: 58K2391
D32 = smaj_10:SMAJ*CA: SMAJ Series TVS Diodes Source: http://www.littelfuse.com/~/media/electronics/datasheets/tvs_diodes/littelfuse_tvs_diode_smaj_datasheet.pdf.pdf; MF: Littelfuse; MPN: SMAJ15CA; OC_FARNELL: 1827670; OC_NEWARK: 71J1959
F5 = SparkFun-Fuses:PPTC: Resettable Fuse PPTC Resettable Fuse. Really a sort of resistor with a polymeric positive temperature coefficient whose resistance increases dramatically with an increase in temperature. When heated by the power passing through the resistance rises causing the current to be limited, protecting the circuit. This is achieved by the transition of the polymer from a crystalline to an amorphous state where the conductive carbon separates breaking the conductive pathways found in the cool crystalline structure. When a PPTC cools back down it resumes conducting letting the circuit turn back on. SparkFun Products: SparkFun RedBoard - Programmed with Arduino <https://www.sparkfun.com/products/12757> Pro Micro - 5V/16MHz <https://www.sparkfun.com/products/12640> Arduino Pro 328 - 5V/16MHz <https://www.sparkfun.com/products/10915> MP3 Trigger <https://www.sparkfun.com/products/13720>; PROD_ID: RES-11150; VALUE: 6V/0.75A
IC2 = linear:LM339: Low Power Low Offset Voltage Quad Comparators with open collector; LM139/LM239/LM339/LM2901/LM3302
J2 = SparkFun-Connectors:CONN_11: Multi connection point. Often used as Generic Header-pin footprint for 0.1 inch spaced/style header connections On any of the 0.1 inch spaced packages, you can populate with these: Break Away Headers - Straight <https://www.sparkfun.com/products/116> (PRT-00116) Break Away Male Headers - Right Angle <https://www.sparkfun.com/products/553> (PRT-00553) Female Headers <https://www.sparkfun.com/products/115> (PRT-00115) Break Away Headers - Machine Pin <https://www.sparkfun.com/products/117> (PRT-00117) Break Away Female Headers - Swiss Machine Pin <https://www.sparkfun.com/products/743> (PRT-00743) For SCREWTERMINALS and SPRING TERMINALS visit here: Screw Terimnals on SparkFun.com <https://www.sparkfun.com/search/results?term=Screw+Terminals> (5mm/3.5mm/2.54mm spacing) This device is also useful as a general connection point to wire up your design to another part of your project. Our various solder wires solder well into these plated through hole pads. Hook-Up Wire - Assortment (Stranded, 22 AWG) <https://www.sparkfun.com/products/11375> (PRT-11375) Hook-Up Wire - Assortment (Solid Core, 22 AWG) <https://www.sparkfun.com/products/11367> (PRT-11367) View the entire wire category on our website here <https://www.sparkfun.com/categories/141>
J3 = SparkFun-Connectors:USB_B: USB Type B Connector SparkFun Products: SparkFun Stepoko <https://www.sparkfun.com/products/13899> PTH; PROD_ID: CONN-08278; SF_ID: PRT-00139
J5 J6 = SparkFun-Connectors:CONN_14: Multi connection point. Often used as Generic Header-pin footprint for 0.1 inch spaced/style header connections On any of the 0.1 inch spaced packages, you can populate with these: Break Away Headers - Straight <https://www.sparkfun.com/products/116> (PRT-00116) Break Away Male Headers - Right Angle <https://www.sparkfun.com/products/553> (PRT-00553) Female Headers <https://www.sparkfun.com/products/115> (PRT-00115) Break Away Headers - Machine Pin <https://www.sparkfun.com/products/117> (PRT-00117) Break Away Female Headers - Swiss Machine Pin <https://www.sparkfun.com/products/743> (PRT-00743) For SCREWTERMINALS and SPRING TERMINALS visit here: Screw Terimnals on SparkFun.com <https://www.sparkfun.com/search/results?term=Screw+Terminals> (5mm/3.5mm/2.54mm spacing) This device is also useful as a general connection point to wire up your design to another part of your project. Our various solder wires solder well into these plated through hole pads. Hook-Up Wire - Assortment (Stranded, 22 AWG) <https://www.sparkfun.com/products/11375> (PRT-11375) Hook-Up Wire - Assortment (Solid Core, 22 AWG) <https://www.sparkfun.com/products/11367> (PRT-11367) View the entire wire category on our website here <https://www.sparkfun.com/categories/141> Special notes: Molex polarized connector foot print use with SKU : PRT-08231 with associated crimp pins and housings. 1MM SMD Version SKU: PRT-10208 NOTES ON THE VARIANTS LOCK and LOCK_LONGPADS... This footprint was designed to help hold the alignment of a through-hole component (i.e. 6-pin header) while soldering it into place. You may notice that each hole has been shifted either up or down by 0.005 of an inch from it's more standard position (which is a perfectly straight line). This slight alteration caused the pins (the squares in the middle) to touch the edges of the holes. Because they are alternating, it causes a "brace" to hold the component in place. 0.005 has proven to be the perfect amount of "off-center" position when using our standard breakaway headers. Although looks a little odd when you look at the bare footprint, once you have a header in there, the alteration is very hard to notice. Also,if you push a header all the way into place, it is covered up entirely on the bottom side.
R6-R12 R14-R32 R35-R39 R41-R46 = SparkFun-Resistors:0.3OHM: 0.3Ω resistor A resistor is a passive two-terminal electrical component that implements electrical resistance as a circuit element. Resistors act to reduce current flow, and, at the same time, act to lower voltage levels within circuits. - Wikipedia; PROD_ID: RES-11622
R13 = prywatne:3521130RFT: TE CONNECTIVITY (TE) SMD POWER RESISTOR: 3521 130R 1% 2W
R33 R34 = SparkFun-Resistors:0.1OHM: 0.1Ω resistor A resistor is a passive two-terminal electrical component that implements electrical resistance as a circuit element. Resistors act to reduce current flow, and, at the same time, act to lower voltage levels within circuits. - Wikipedia; PROD_ID: RES-12374; VALUE: 0.1
R40 = SparkFun-Resistors:10OHM: 10Ω resistor A resistor is a passive two-terminal electrical component that implements electrical resistance as a circuit element. Resistors act to reduce current flow, and, at the same time, act to lower voltage levels within circuits. - Wikipedia; PROD_ID: RES-08705; VALUE: 10
T1-T3 T6 = nxp_60:2N7002: N-channel TrenchMOS FET N-channel enhancement mode Field-Effect Transistor (FET) in a plastic package using TrenchMOS technology. AAL Eindhoven MK
T7 T8 = transistor (2):*-NPN-: NPN Transistror BF959 corrected 2008.03.06
T9 = nxp_60:BSS84A: 50 V, 150 mA P-channel Trench MOSFET P-channel enhancement mode Field-Effect Transistor (FET) in a small Surface-Mounted Device (SMD) plastic package using Trench MOSFET technology. AAL Eindhoven MK
U1 U2 = Goodies:MCP2562
U9 = SparkFun-IC-Power:V_REG_317: Voltage Regulator Standard LM317 adjustable voltage regulator. AOI (Adjust Output Input). Google 'LM317 Calculator' for easy to use app to get the two resistor values needed. 240/720 for 5V output. 240/390 for 3.3V output. Spark Fun Electronics SKU : COM-00527
U10 = Goodies:TH8056-KDC-A8: The Melexis TH8056 is a physical layer device for a single wire data link capable of operating with various CSMA/CR protocols such as the Bosch Controller Area Network (CAN) version 2.0. The TH8056 transceiver is designed in accordance with the Single Wire CAN Physical Layer Specification GMW3089 V2.3 and supports many additional features like under-voltage lock-out, time-out for faulty blocked input signals, output blanking time in case of bus ringing and a very low sleep mode current.
U15 = Goodies:NCP1117: NCP1117 Avaiable in DPAK (TO-252) and SOT223 package 1.0 A Low-Dropout Positive Fixed and Adjustable Voltage Regulators
U19 = Goodies:ZLDO1117: ZLDO1117 Avaiable in DPAK (TO-252) and SOT-223 package ZLDO1117 is a low dropout positive adjustable or fixed-mode regulator with 1A output current capability. The ZLDO1117 has a 2% tolerance across the industrial temperature range and is guaranteed to have lower than 1.2V dropout at full load current making it ideal to provide well-regulated outputs of 1.2V to 5.0V with input supply voltages up to 18V. The ZLDO1117 is ideally suited to provide well-regulated supplies for low voltage IC applications such as high-speed bus termination and low current 3.3V logic supply across the whole industrial temperature range.

## Board
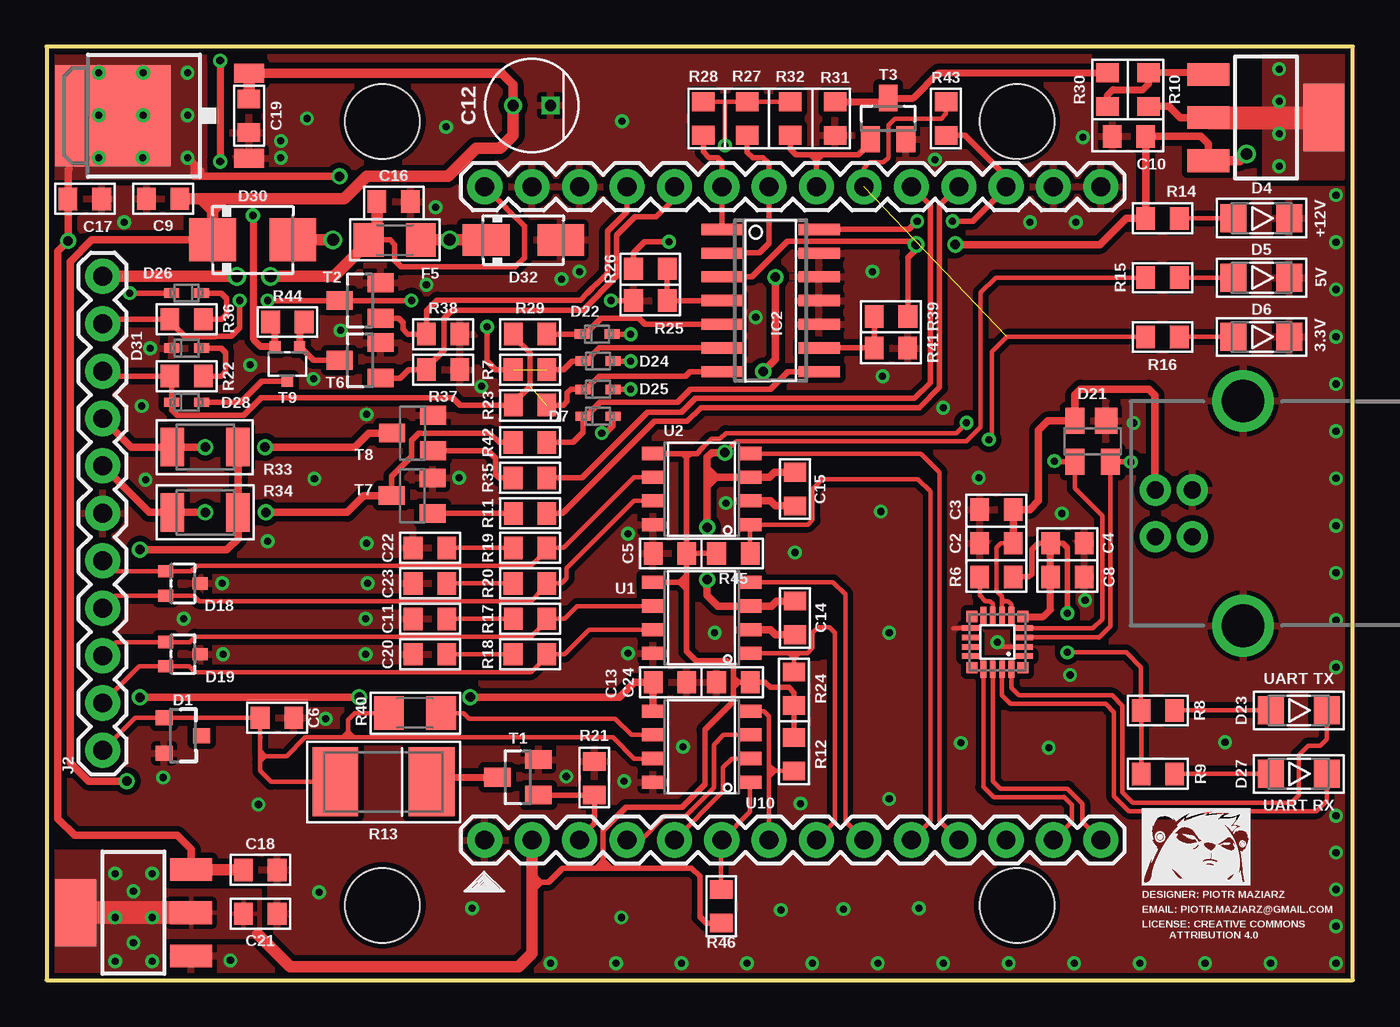
[diagram p8: board, top side]
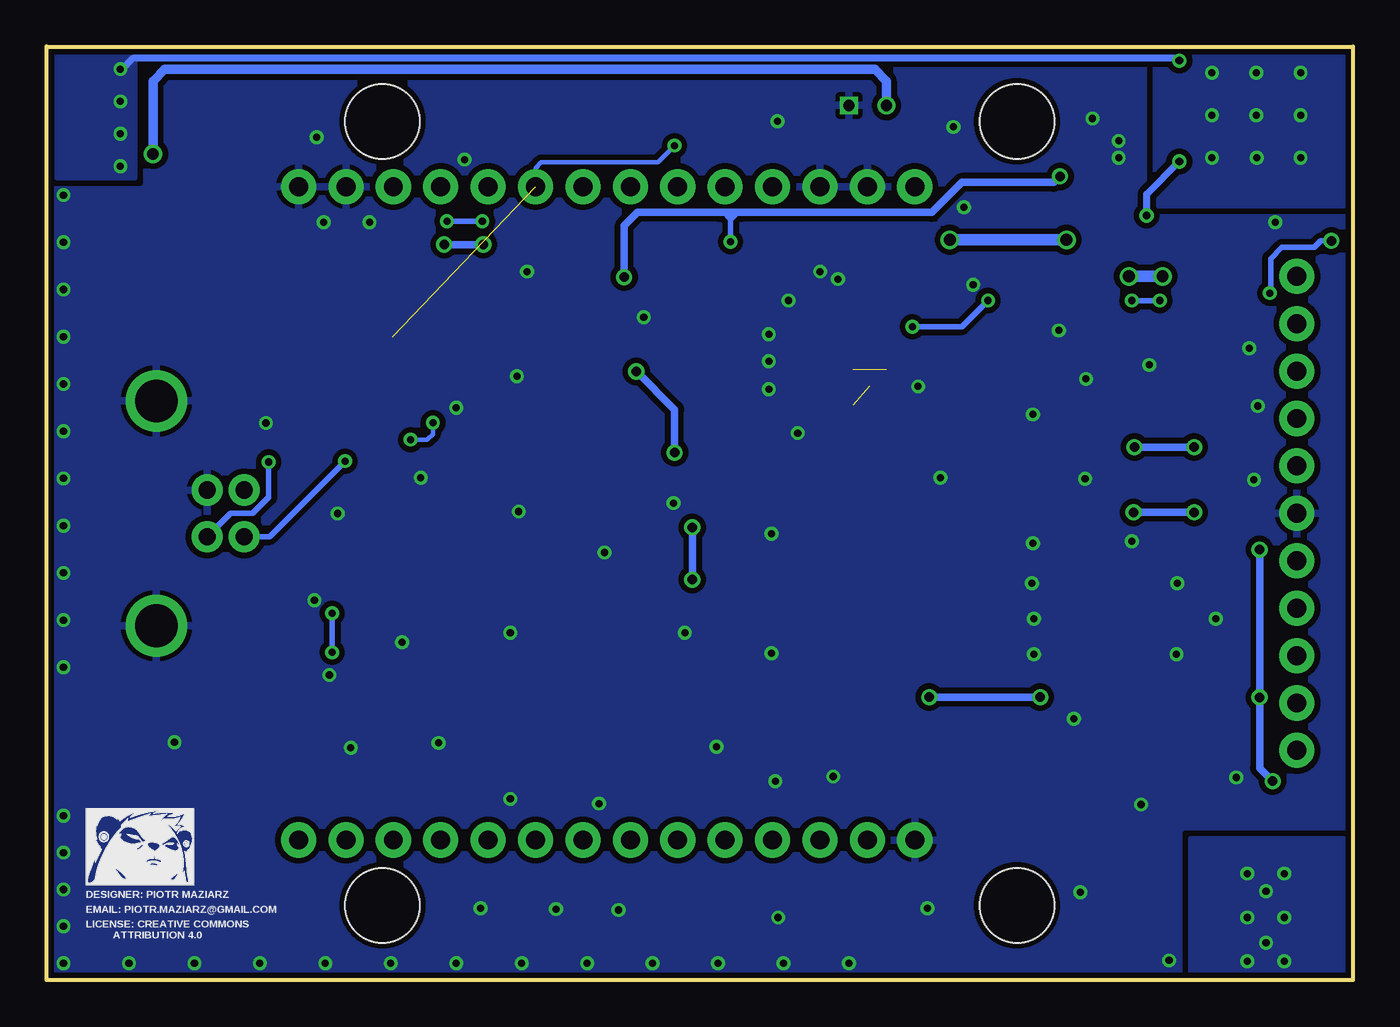
[diagram p9: board, bottom side, seen from below]

Size 70 x 50 mm. Coordinates in mm from the lower left corner, seen from the top.
Outline: 0,0 70,0 70,50 0,50 0,0
Copper layers (1*16): Top 0.035mm / dielectric 1.5mm / Bottom 0.035mm
Design rules "SparkFun-2-layer-TIGHT": minimum track width 7mil, minimum drill 15mil, track to track 7mil, track to pad 7mil, pad to pad 7mil, via to via 7mil, smd to smd 7mil, copper to edge 7mil, drill to drill 7mil, minimum pad ring 7mil, minimum via ring 7mil, stop-mask expansion 4mil, vias tented up to drill 25mil, thermal gap 10mil
Holes 4 mm at 52,46 18,46 18,4 52,4

### Footprints (pad centres in the part's own frame; a part is rotated, then mirrored left to right if it is on the bottom)
0805 = smd 1 x 1.2: 1 -0.9,0; 2 0.9,0
5X11 = drill 0.6 square: 1 -1,0 | drill 0.6: 2 1,0
QFN20 = smd 0.6 x 0.6: 1 -1.37,1.37; 6 -1.37,-1.37; 11 1.37,-1.37; 16 1.37,1.37 | smd 0.9 x 0.3: 2 -1.445,0.75; 3 -1.445,0.25; 4 -1.445,-0.25; 5 -1.445,-0.75; 12 1.445,-0.75; 13 1.445,-0.25; 14 1.445,0.25; 15 1.45,0.75 | smd 0.3 x 0.9: 7 -0.75,-1.445; 8 -0.25,-1.445; 9 0.25,-1.445; 10 0.75,-1.445; 17 0.75,1.445; 18 0.25,1.445; 19 -0.25,1.445; 20 -0.75,1.445
SOT23-3 = smd 0.8 x 0.9: 1 -0.95,-1; 2 0.95,-1; 3 0,1
WL-SMCW_1206 = smd 1.4 x 1.5: 1 -1.5,0; 2 1.5,0
SOD-523F = smd 0.8 x 0.5: A -0.8,0; C 0.8,0
SOT323 = smd 0.65 x 0.8: 1 -0.65,-0.925; 2 0.65,-0.925; 3 0,0.925
SOT143-4 = smd 1.2 x 1.4: 1 -0.725,-1.1 | smd 1 x 1.4: 2 0.95,-1.1; 3 0.95,1.1; 4 -0.95,1.1
DO214AA = smd 2.5 x 2.3: A 2.15,0; C -2.15,0
DO214AC = smd 2.5 x 1.7: A 2,0; C -2,0
1206 = smd 1.6 x 1.8: 1 -1.4,0; 2 1.4,0
SO14 = smd 0.6 x 2.2: 1 -3.81,-2.6; 2 -2.54,-2.6; 3 -1.27,-2.6; 4 0,-2.6; 5 1.27,-2.6; 6 2.54,-2.6; 7 3.81,-2.6; 8 3.81,2.6; 9 2.54,2.6; 10 1.27,2.6; 11 0,2.6; 12 -1.27,2.6; 13 -2.54,2.6; 14 -3.81,2.6
1X11 = drill 1.016 pad 1.88: 1 0,0; 2 2.54,0; 3 5.08,0; 4 7.62,0; 5 10.16,0; 6 12.7,0; 7 15.24,0; 8 17.78,0; 9 20.32,0; 10 22.86,0; 11 25.4,0
USB-B-PTH = drill 0.914 pad 1.676: D+ 4,1.25; D- 5.981,1.25; GND 4,-1.25; VBUS 5.981,-1.25 | drill 2.286: SHLD1 1.282,-6.02; SHLD2 1.282,6.02
1X14 = drill 1.016 pad 1.88: 1 0,0; 2 2.54,0; 3 5.08,0; 4 7.62,0; 5 10.16,0; 6 12.7,0; 7 15.24,0; 8 17.78,0; 9 20.32,0; 10 22.86,0; 11 25.4,0; 12 27.94,0; 13 30.48,0; 14 33.02,0
3521 = smd 2.45 x 3.7: 1 -2.575,0; 2 2.575,0
1210 = smd 1.27 x 2.06: 1 -1.755,0; 2 1.755,0
SOT23 = smd 1 x 1.4: 1 -0.95,-1.1; 2 0.95,-1.1; 3 0,1.1
SOT23-BEC = smd 1 x 1.4: B -0.95,-1.1; C 0,1.1; E 0.95,-1.1
SOT323' = smd 0.6 x 0.6: 1 -0.65,-0.925; 2 0.65,-0.925; 3 0,0.925
SOIC-8 = smd 0.7 x 1.2: 1 -1.905,-2.6; 2 -0.635,-2.6; 3 0.635,-2.6; 4 1.905,-2.6; 5 1.905,2.6; 6 0.635,2.6; 7 -0.635,2.6; 8 -1.905,2.6
SOT223 = smd 1.219 x 2.235: 1 -2.311,-3.099; 2 0,-3.099; 3 2.311,-3.099 | smd 3.6 x 2.2: 4 0,3.099
TO-252 = smd 1 x 1.6: 1 -2.28,-4.8; 3 2.28,-4.8 | smd 5.4 x 6.2: 2 0,2.5

### Placement (x,y rotation side)
C2  50.9,23.4 180 top
C3  50.9,25.2 180 top
C4  54.7,23.4 0 top
C5  33.4,22.85 180 top
C6  12.35,14.05 0 top
C8  54.7,21.6 0 top
C9  6.25,41.85 180 top
C10  58,45.2 180 top
C11  20.54,19.35 180 top
C12  26,46.85 180 top
C13  33.4,15.95 0 top
C14  40.1,19.4 270 top
C15  40.1,26.3 270 top
C16  18.6,41.7 0 top
C17  2.05,41.85 0 top
C18  11.45,5.9 0 top
C19  10.85,46.3 270 top
C20  20.54,17.45 180 top
C21  11.45,3.55 0 top
C22  20.54,23.15 180 top
C23  20.54,21.25 180 top
C24  36.8,15.95 180 top
CP1202N  50.95,18.1 180 top
D1  7.3,13.09 270 top
D4  65.1,40.8 180 top
D5  65.1,37.62 180 top
D6  65.1,34.45 180 top
D7  29.55,30.2 180 top
D18  7.3,21.24 270 top
D19  7.31,17.46 270 top
D21  56.05,28.87 180 top
D22  29.5,34.6 180 top
D23  67.1,14.44 180 top
D24  29.55,33.16 180 top
D25  29.55,31.64 180 top
D26  7.5,36.8 0 top
D27  67.1,11.04 180 top
D28  7.5,30.95 180 top
D30  11.05,39.65 0 top
D31  7.5,33.85 180 top
D32  25.55,39.65 0 top
F5  18.65,39.65 0 top
IC2  38.8,36.4 270 top
J2  3,12.3 90 top
J3  65.4,25 180 top
J5  56.5,7.5 180 top
J6  56.5,42.5 180 top
R6  50.9,21.6 180 top
R7  25.89,32.7 0 top
R8  59.55,14.44 180 top
R9  59.55,11.04 180 top
R10  59.05,47.7 270 top
R11  25.9,25 180 top
R12  40.05,12.1 90 top
R13  18.05,10.61 180 top
R14  59.8,40.8 180 top
R15  59.8,37.62 180 top
R16  59.8,34.45 180 top
R17  25.9,19.35 0 top
R18  25.9,17.45 0 top
R19  25.9,23.15 0 top
R20  25.9,21.25 0 top
R21  29.35,10.81 90 top
R22  7.5,32.35 180 top
R23  25.9,30.8 180 top
R24  40.05,15.6 270 top
R25  32.35,36.4 0 top
R26  32.35,38.1 180 top
R27  37.54,46.15 90 top
R28  35.19,46.15 90 top
R29  25.9,34.6 0 top
R30  56.85,47.7 270 top
R31  42.25,46.15 90 top
R32  39.85,46.15 90 top
R33  8.5,28.55 0 top
R34  8.5,25.05 0 top
R35  25.9,26.9 180 top
R36  7.5,35.4 0 top
R37  21.25,32.7 180 top
R38  21.25,34.6 180 top
R39  45.25,35.55 0 top
R40  19.74,14.3 180 top
R41  45.25,33.85 180 top
R42  25.9,28.8 0 top
R43  48.2,46.15 90 top
R44  12.9,35.25 180 top
R45  36.8,22.85 180 top
R46  36.15,3.95 270 top
T1  25.25,10.86 90 top
T2  16.8,36.4 90 top
T3  45.1,46.15 0 top
T6  16.8,33.2 90 top
T7  19.59,25.95 90 top
T8  19.61,29.3 90 top
T9  RU1E002SPTCL  [SOT323']  12.9,33 180 top
U1  35.1,19.4 90 top
U2  35.1,26.3 90 top
U9  65.35,46.2 270 top
U10  35.1,12.5 90 top
U15  6.05,46.3 90 top
U19  4.65,3.6 90 top
U$1  [LOGO2]  58.7,5.1 0 top
U$2  [LOGO2]  67.9,5.1 0 bottom

### Tracks (layer width: path | path; a pad name or v marks a point on that pad's centre or on a via)
3.3V  (via drill 0.38, 0.38 pad 0.55)  (1 unrouted)
  Top 0.254: 36.35,47.05 R28.2 | 36.35,47.05 R27.2 R32.2 | R28.2 | 48.1,47.05 R43.2 48.2,46.4 47.95,46.15 45.45,46.15 45.1,45.8 45.1,44.05 44.85,43.8 44.1,43.8 43.8,43.5 J6.6 | 29.45,6 29.86,6 30.35,6 30.79,6 | v36.35,44.7 36.35,47.05 | v50.5,28.95 50.65,29.1 50.65,33.64 51.46,34.45 R16.2 | v49.3,29.85 48.74,29.29 36.4,29.29 36.1,28.99 35.63,28.99 35.15,28.5
  Top 0.305: 37.7,16.05 C24.1 | 37.7,15.85 C24.1 | 36.8,15.85 36.8,16.2 | 36.8,16.2 36.8,16.75 36.45,17.1 34.8,17.1 34.3,17.6 34.3,20.95 | 36.8,15.85 36.8,15.7 | 36.8,15.7 36.8,14.92 35.28,13.4 35.28,10.49 34.04,9.25 31.06,9.25 29.83,8.03 29.83,6.38 | 37.05,15.95 C24.1 | 37.05,15.95 36.9,15.95 36.8,15.85 | 26.07,6 26.02,5.95 26.02,5.71 26.48,5.25 | R24.2 39.95,14.7 | R12.2 R24.2 | 34.15,22.7 C5.1 | C5.1 R45.2 | 34.3,21.35 34.3,21.66 | 34.3,21.66 C5.1 | 34.3,21.35 34.3,20.95 | 33.95,21.3 U1.5 | 33.95,21.3 34.26,21.3 34.3,21.35 | C24.1 38.5,15.95 38.78,15.67 39.78,15.67 40.05,15.4 R24.2 | 34.3,21.66 33.95,21.3 | 34.3,20.95 33.95,21.3 | 36.8,16.2 37.05,15.95 | 36.8,15.7 37.05,15.95 | 26.02,5.25 26.48,5.25 | 29.45,6 27.65,6 26.9,5.25 26.48,5.25 | 26.02,4.85 26.08,4.85 26.48,5.25 | 29.83,6.38 29.83,6.03 29.86,6 | 29.45,6 30.21,6 | 29.45,6 29.83,6.38 | 30.21,6 30.35,6 34.57,6 35,5.57 35,3.4 35.35,3.05 R46.2 | 30.21,6 29.83,6.38 | U2.5 34.1,28.2 | 34.27,28.2 34.1,28.2 | 34.27,28.2 34.5,28.2 | 34.5,28.2 34.85,28.2 35.15,28.5 | 34.27,28.2 34.3,28.17 34.3,28 | 34.3,28 C5.1 | 34.5,28.2 34.3,28 | 34.1,28.2 34.3,28
  Top 0.61: J5.13 26.02,5.95 26.02,5.25 26.02,4.85 26.02,1.42 25.3,0.7 13.05,0.7 11.3,2.45
  Top 1.22: U19.2 U19.4
  Bottom 0.254: J6.6 43.8,43.5 43.5,43.8 37.25,43.8 v36.35,44.7 | v49.3,29.85 49.3,29.25 49.6,28.95 v50.5,28.95
  other vias: 5.65,5.7 3.67,5.7 3.67,1 5.65,1 4.65,2 4.65,4.75 3.67,3.35 5.65,3.35
  pour Top (isolate 0.305, no thermals): 6.25,6.88 0.47,6.88 0.47,0.33 6.2,0.33
  pour Top (isolate 0.305): 6.25,2.3 11.45,2.3 11.45,4.8 6.25,4.8
  pour Bottom (isolate 0.305): 0.5,7.6 8.7,7.6 8.7,0.25 0.5,0.25
5V  (via drill 0.38, 0.51)
  Top 0.254: v36.35,28.25 36.92,28.82 36.94,28.82 36.97,28.86 49.29,28.86 50.05,29.62 50.05,36.81 50.86,37.62 R15.2
  Top 0.305: D26.A v4.45,36.8 | R26.2 31.45,38.95 32.05,39.55 v33.35,39.55
  Top 0.406: C14.1 39.1,20.3 38.84,20.04 U1.3 35.98,20.04 35.4,20.62 v35.4,21.45 | C15.1 39,27.2 38.73,26.93 U2.3 35.87,26.93 | 4,46.3 U15.2 | 7.9,43.7 v7.55,44.05 | 7.9,43.7 8.25,43.35 | v15.7,43.05 7.9,43.05 7.9,43.7 | 7.29,5.92 U19.3 7.75,7 7,7.75 1.5,7.75 0.6,8.65 0.6,39.05 v1.15,39.6 C17.1 1.15,43.4 1.2,43.45 | 35.4,26.94 35.4,27.41 | 35.4,26.94 35.4,26.46 | 35.4,26.46 v35.4,24.25 | 35.87,26.93 35.4,26.93 35.4,26.94 | 35.4,27.41 35.87,26.93 | 35.4,26.46 35.87,26.93 | v39.05,37.65 39.05,33.25 v38.4,32.6 | 35.4,27.41 35.4,28 35.65,28.25 v36.35,28.25
  Top 0.61: 2.88,43.97 v2.8,44.05 | U19.3 | U19.3 7.56,6.1 | U19.3 10.54,5.92 C18.1
  Bottom 0.305: v1.15,39.6 1.71,39.6 2.06,39.25 3.8,39.25 4.4,38.65 4.4,36.85 v4.45,36.8 | 33.35,40.77 v33.35,39.55 | 33.35,40.77 33.35,41.1 33.38,41.12 | 32.75,41.12 32.99,41.12 33.35,40.77 | 34,41.12 33.71,41.12 33.35,40.77
  Bottom 0.406: v36.35,28.25 36.35,30.55 v38.4,32.6 | v35.4,24.25 v35.4,21.45 | v39.05,37.65 39.05,40.4 38.32,41.12 34,41.12 33.38,41.12 32.75,41.12 22.56,41.12 20.96,42.73 16.02,42.73 v15.7,43.05
  other vias: 2.8,48.6 5.17,48.6 7.55,48.6 2.8,46.33 5.17,46.33 5.15,44.05 7.55,46.33
  pour Top (isolate 0.305, no thermals): 0.5,49.5 8.5,49.5 8.5,42.95 0.5,42.95
  pour Bottom (isolate 0.305): 0.5,49.5 10.65,49.5 10.65,41.45 0.5,41.45
!ISO_K_TX
  Top 0.305: 47.85,41.5 48.85,42.5 J6.4 47.85,41.47 47.85,31.75 46.77,30.67 35.07,30.67 34.33,29.93 32.58,29.93 27.65,25 R11.1
!ISO_L_TX
  Top 0.305: J6.5 47.35,41.5 47.35,32 46.52,31.17 34.78,31.17 | R35.1 28.7,26.9 32.21,30.41 34.02,30.41 34.78,31.17 | 34.78,31.17 36.3,31.17 | 34.78,31.17
!ISO_RX  (via drill 0.38)
  Top 0.305: R43.1 49.2,45.25 51.42,43.03 J6.3 51.42,42.43 49.64,40.65 v48.55,40.65 | v46.65,40.65 46.21,40.21 IC2.14
  Bottom 0.305: v46.65,40.65 v48.55,40.65
!J1850_BUS-_TX
  Top 0.305: T2.1 18.85,35.45 19.1,35.2 19.1,34.85 19.35,34.6 R38.2 20.35,35.84 20.93,36.42 28.6,36.42 28.96,36.78 | T2.1 | J6.11 31.1,41.15 30.07,40.11 30.07,37.89 29.86,37.69 | 29.21,37.03 29.86,37.69 | 28.96,36.78 29.23,37.05 | 29.86,37.69 | 29.86,37.69 28.96,36.78
ADJ
  Top 0.381: U9.1 62.24,48.5 62.14,48.6 R10.1 59.05,48 58.75,47.7 57.15,47.7 56.85,47.4 R30.2
COMPARATOR+
  Top 0.305: D22.C R29.2 | D22.C | D22.C | IC2.5 32.07,35.13 31.75,35.45 29.7,35.45 28.85,34.6 D22.C
COMPARATOR-
  Top 0.305: R26.1 R25.2 IC2.4
D+  (via drill 0.38)
  Top 0.254: D21.4 57,18.94 56.4,18.34 56.39,18.35 CP1202N.4
  Top 0.305: D21.4 58.08,27.77 v58.1,27.75
  Bottom 0.305: v58.1,27.75 58.1,25.85 58.95,25 60.15,25 J3.D+
D-  (via drill 0.38)
  Top 0.254: D21.3 55.1,26.35 56.57,24.88 56.57,19.34 56.07,18.84 56.06,18.85 CP1202N.5
  Top 0.305: D21.3 54.03,27.77 v54,27.8
  Bottom 0.305: J3.D- 58.05,23.75 v54,27.8
DLC  (via drill 0.51, 0.64 pad 0.55)
  Top 0.305: IC2.3 37.8,37.67 39.7,39.57 46.43,39.57 v46.6,39.4 46.6,39.15 46.15,38.7 R39.2
  Top 0.406: U9.3 62.26,43.9 62.25,43.91 62.25,44.8 61.85,45.2 C10.1 58.9,45.1 | C13.1 U10.5 | C13.1 | R33.2 R34.2 10.25,23.65 9.65,23.05 v5,23.05 | v4.3,10.65 2.25,10.65 1.25,11.65 1.25,38.48 2.42,39.65 D30.C | v5,15.15 v16.75,15.15 | C13.1 31.5,15.95 30.7,15.15 v22.7,15.15 | C13.1 | 58.9,45.1 R14.2 57.85,40.8 56.45,39.4 v48.7,39.4 | 58.9,45.1
  Top 0.508: U9.3 63.94,43.89 v64.3,44.25 | U15.3 24.37,48.58 25,47.95 C12.2
  Top 0.61: 11.18,48.58 U15.3 C19.1 | C19.1 | 8.91,41.85 9.43,41.85 | 8.91,41.85 8.28,41.85 | 8.28,41.85 C9.1 | 9.43,41.85 9.52,41.85 | 9.52,41.85 15.95,41.85 17.15,43.05 21.5,43.05 23,44.55 24.3,44.55 25,45.25 C12.2 | 9.45,41.83 9.43,41.85 | 8.9,41.23 D30.C 9.21,39.65 | 8.9,41.23 8.9,41.84 8.91,41.85 | 8.28,41.85 8.9,41.23 | 9.52,41.85 8.9,41.23
  Bottom 0.406: v5,23.05 v5,15.15 5,11.35 v4.3,10.65 | v16.75,15.15 v22.7,15.15 22.75,15.15 | v48.7,39.4 v46.6,39.4
  Bottom 0.508: C12.2 25,48.15 25.62,48.78 63.67,48.78 64.3,48.15 v64.3,44.25
DLC_RAW  (via drill 0.64)
  Top 0.305: F5.1 18.4,39.65 18.65,39.4 18.65,38.55 19,38.2 25.1,38.2 25.6,38.7 25.6,40.37 24.61,41.35 24.61,41.37 J6.14
  Top 0.61: C16.1 17.7,40.1 F5.1 17.25,39.55 15.4,37.7 v12,37.7 | J2.11 v10.2,37.7
  Bottom 0.61: v10.2,37.7 v12,37.7
DLC_RAW2  (via drill 0.64)
  Top 0.61: D32.C v21.6,39.65 F5.2 | D30.A v15.35,39.65
  Bottom 0.61: v21.6,39.65 v15.35,39.65
GND  (via drill 0.38)
  Top 0.254: CP1202N.12 48.6,18.85 | CP1202N.3 51.2,17.85 v50.95,18.1
  Top 0.305: D22.A v31.3,34.6 | D24.A v31.29,33.16 v31.3,33.15 | D25.A v31.29,31.64 v31.3,31.65 | v29.75,29.3 29.95,29.3 30.35,29.7 D7.A | R25.1 v30.25,36.4
  Top 0.406: U2.2 38.78,25.66 39.05,25.4 C15.2 | U1.2 38.78,18.77 39.05,18.5 C14.2
  other vias: 9.45,17.45 7.35,19.35 17.2,21.25 15.75,34.8 20.35,37.25 23.3,31.8 44.8,32.35 30.83,46 47.6,43.95 14.6,4.7 11.35,9.4 22.8,3.85 27.85,10.9 14.95,14 44.25,37.95 9.85,1.05 55.15,40.6 12.55,44.05 49.95,26.9 35.8,18.6 45.15,18.6 34.1,12.5 20.85,41.4 4.15,40.6 36.4,25.55 30.95,10.65 22.1,26.9 14.35,26.85 5.3,26.8 5.55,33.85 17.15,30.3 5.1,30.75 11.85,23.5 38,35.5 27.6,37.55 31.15,23.9 31.15,17.5 12.55,44.95 17.1,17.45 9.4,21.25 63.15,12.74 48.05,30.65 40.4,9.45 49,12.7 54.85,16.34 53.7,12.44 58.25,29.84 54.4,24.99 55.65,20.34 27,0.9 30.51,0.9 34.02,0.9 37.52,0.9 41.03,0.9 44.54,0.9 48.05,0.9 51.56,0.9 55.07,0.9 58.57,0.9 62.08,0.9 65.59,0.9 69.1,0.9 69.1,2.88 69.1,4.85 69.1,6.83 69.1,8.8 69.1,42.05 69.1,39.52 69.1,36.99 69.1,31.93 69.1,29.4 69.1,26.87 69.1,24.34 69.1,21.81 69.1,19.28 69.1,16.75 69.1,34.46 17.1,19.35 17.15,23.4 40.1,22.9 44.7,25.1 45.15,9.7 30.8,3.35 39.35,3.75 42.7,3.8 46.75,3.85 6.25,10.85 28.55,37.95 13.95,46.15 21.4,45.7 55.53,45.15 10.9,32.95 14.3,32.2 52.7,40.6
  pour Bottom (isolate 0.305, rank 2): -1,51 72,51 72,-1 -1,-1
  pour Top (isolate 0.305, rank 2): -2,52 73,52 73,-2 -2,-2
HS_CAN_H
  Top 0.254: J2.4 3.67,20.59 D18.2 7.87,20.59 8.16,20.3 25.95,20.3 26.58,20.93 | U2.7 31.46,25.66 27.87,22.07 27.87,21.53 27.59,21.25 R20.2
  Top 0.305: 26.58,20.93 26.8,21.15 R20.2
HS_CAN_L
  Top 0.254: J2.5 3.57,21.89 D18.1 7.76,21.89 8.06,22.2 25.95,22.2 26.8,23.05 | R19.2 27.7,23.15 31.48,26.93 U2.6
  Top 0.305: 26.8,23.05 R19.2
HS_CAN_RX
  Top 0.254: J5.4 47.85,8.53 47.85,27.2 46.84,28.2 U2.4
HS_CAN_TX
  Top 0.254: R45.1 37.7,24.18 | U2.1 40.8,24.39 41.05,24.65 41.05,26.29 41.58,26.82 46.7,26.82 47.35,26.17 47.35,8.51 J5.5
  Top 0.305: 37.7,24.18 U2.1
J1850_BUS+  (1 unrouted)
  Top 0.305: R29.1 25,34.5 25.9,33.6 25.9,31.8 25,30.9 R23.2 22.15,30.8 21.75,31.2 11.5,31.2 10.55,30.25 7,30.25 6.7,30.55 D28.C 6.7,32.25 R22.2 3.27,32.35 J2.9 | IC2.7 34.47,32.59 34.23,32.35 29.6,32.35 28.89,31.64 D25.C 28.09,31.64 27.9,31.45 27.9,31 27.7,30.8 R23.1
J1850_BUS+_TX
  Top 0.305: R37.2 20.35,32.28 20.32,32.25 | R37.2 | T6.1 18.95,32.25 19.4,32.7 R37.2 | R37.2 20.35,32.8 21.29,33.74 21.29,35.44 21.72,35.88 28.74,35.88 30.55,37.69 30.55,39.9 31.53,40.88 32.67,40.88 33.64,41.86 J6.10
J1850_BUS-  (via drill 0.38)  (1 unrouted)
  Top 0.305: T2.3 | T2.3 | R7.1 24.05,32.7 23.6,33.15 v23.6,35 | T2.3 v19.55,36.4 | v19.55,36.4 | R7.2 27.7,32.7 28.16,33.16 D24.C 28.91,33.16 29.61,33.86 IC2.6 | J2.10 3.24,35.4 R36.1 6.6,35.3 7.43,34.47 9.04,34.47 9.07,34.5 9.9,34.5 10.35,34.95 v10.35,36.4 | T2.3 v11.85,36.4 | v11.85,36.4
  Bottom 0.305: v23.6,35 20.95,35 v19.55,36.4 | v11.85,36.4 v10.35,36.4
K-LINE
  Top 0.305: 40.44,32.59 IC2.8 39.74,32.59 38.8,31.65 34.5,31.65 33.8,30.95 29.65,30.95 28.9,30.2 D7.C 28.75,29.35 28.2,28.8 R42.2
K_LINE  (via drill 0.51)
  Top 0.305: R42.1 24.24,28.8 23.74,29.3 19.95,29.3 19.55,28.9 19.55,28.05 18.49,26.99 T7.C
  Top 0.406: J2.7 5.49,25.05 R34.1 v8.5,25.05 | v11.75,25.05 16.1,25.05 17,25.95 T7.C
  Bottom 0.406: v8.5,25.05 v11.75,25.05
L_LINE  (via drill 0.51)
  Top 0.406: J2.8 4.53,28.55 R33.1 v8.5,28.55 | v11.7,28.55 16.5,28.55 17.25,29.3 T8.C
  Bottom 0.406: v8.5,28.55 v11.7,28.55
LOAD
  Top 0.254: U10.6 31.33,13.13 30.47,14 22.65,14 22.34,14.3 R40.1
  Top 0.305: 32.27,13.13 U10.6
MS_CAN_H
  Top 0.254: 26.8,17.35 25.95,16.5 7.95,16.5 7.64,16.81 D19.2 4.97,16.81 J2.2 | U1.7 29.07,18.77 27.75,17.45 R18.2 | R18.2
  Top 0.305: R18.2 26.8,17.35
MS_CAN_L
  Top 0.254: J2.3 3.73,18.11 D19.1 7.66,18.11 7.95,18.4 25.95,18.4 26.8,19.25 26.9,19.35 27.75,19.35 28.43,20.04 U1.6
  Top 0.305: 26.8,19.25 R17.2
MS_CAN_RX
  Top 0.254: U1.4 42.15,21.3 42.8,20.66 42.8,8.5 J5.6
  Top 0.305: U1.4
MS_CAN_TX
  Top 0.254: J5.7 42.25,8.5 42.25,18.61 41.96,18.9 41.35,18.9 41.05,18.6 41.05,17.79 40.76,17.5 40.55,17.5 | 40.04,17.5 39.4,17.5 | 39.4,17.5 U1.1 | 40.04,17.5 40.55,17.5 | 40.05,17.23 R24.1 | 40.05,17.23 40.05,17.49 40.04,17.5 | 39.4,17.5 39.79,17.5 40.05,17.23 | 40.55,17.5 40.31,17.5 40.05,17.23
N$1
  Top 0.305: T9.1 13.57,33.92 14.3,33.2 T6.3 | T6.3
  Top 0.381: T9.1 13.55,35 R44.1
N$3
  cutout Top: 28.65,34.65 28.65,35.05 29.05,35.45 34.45,35.45 34.45,30.15 34.2,29.9 32.5,29.9 29.15,26.55 27.7,26.55 27.7,34.55 28.65,34.55
N$5
  Top 0.305: R36.2 9.38,35.4 9.65,35.67 9.65,36.49 9.34,36.8 D26.C
N$8
  Top 0.305: R41.2 IC2.9 | R41.2 | R39.1 44.35,33.87 R41.2
N$9
  Top 0.305: D28.A 10.4,30.95 11.53,32.08 T9.3
N$11
  Top 0.305: R22.1 9.35,32.35 9.6,32.6 9.6,33.6 9.35,33.85 D31.A
N$12
  Top 0.305: R35.2 24.25,26.9 24.05,27.1 24.05,27.95 23.65,28.35 T8.B
N$13
  Top 0.254: 21.95,10.86 20.88,10.86 R13.1
  Top 0.381: 21.43,10.86 21.95,10.86 T1.3
N$14
  Top 0.305: R11.2 T7.B | T7.B
N$15
  Top 0.381: R30.1 47.8,48.6 46.45,47.25 T3.3 44.9,47.05 R31.2
N$17
  Top 0.254: C11.1 R17.1
N$20
  cutout Top: 29.6,37 29.6,35.75 30.75,35.75 30.9,35.75 30.9,37
N$25
  Top 0.254: C20.1 R18.1 | R18.1
N$26
  Top 0.254: C22.1 R19.1
N$27
  Top 0.254: C23.1 R20.1
N$29
  Top 0.254: R16.1 D6.2
N$30
  Top 0.254: R15.1 D5.2
N$32
  Top 0.254: R14.1 D4.2
N$39
  cutout Top: 37.55,24.45 40.7,24.45 40.7,26.55 37.55,26.55 37.55,24.5
N$42
  cutout Top: 37.6,19.65 37.6,17.25 41.35,17.3 41.35,19.7
N$71
  Top 0.254: CP1202N.9 50.7,20.15 50.55,20.3 50.3,20.3 50,20.6 R6.2
N$72
  Top 0.254: D23.1 68.6,12.9 68.25,12.55 67.6,12.55 67.1,12.05 67.1,9.9 66.7,9.5 58.2,9.5 57.65,10.05 57.65,14.7 57.1,15.25 52.1,15.25 51.7,15.65 CP1202N.20
N$73
  Top 0.254: D27.1 68.6,9.6 68.05,9.05 58,9.05 57.2,9.85 57.2,14.35 56.75,14.8 51.65,14.8 51.2,15.25 CP1202N.19
N$74
  Top 0.254: D23.2 R8.1
N$75
  Top 0.254: D27.2 R9.1
PWM/!VPW
  Top 0.305: T3.1 44.15,44.85 43.5,44.2 41.8,44.2 | 41.26,44.2 41.8,44.2 | 41.26,44.2 41,44.2 | 41,44.2 40.15,44.2 39.85,44.5 R32.1 | 41.26,43.56 J6.7 41.26,43.91 | 41.26,43.91 41.26,44.2 | 41.26,44.2 | 41,44.2 41,44.17 41.26,43.91 | 41.8,44.2 41.55,44.2 41.26,43.91
PWM_RX
  Top 0.305: IC2.1 36.18,40.23 J6.9 36.2,42.52 36.2,43.8 35.95,44.05 35.5,44.05 35.19,44.36 R28.1
SW_CAN
  Top 0.254: J2.1 4.74,14.04 D1.1 C6.1 11.45,13.01 | 16.1,13 16.44,13 | 16.44,13 30.35,13 31.48,11.87 U10.7 | 16.1,13 15.86,13 | R40.2 16.5,14.3 16.15,13.95 16.15,13.29 | 16.15,13.29 16.15,13.05 16.1,13 | 15.86,13 16.15,13.29 | 16.44,13 16.15,13.29 | R13.2 12.04,10.61 11.45,11.21 11.45,11.6 | 11.45,12.03 11.45,12.6 | 11.45,12.6 11.45,13.01 | 11.45,12.03 11.45,11.6 | 11.46,13 11.45,13.01 | 15.86,13 13.85,13 12.85,12 11.72,12 | 11.72,12 11.48,12 11.45,12.03 | 11.45,12.6 11.45,12.27 11.72,12 | 11.45,11.6 11.45,11.73 11.72,12
  Top 0.305: 32.23,11.87 U10.7
  Top 0.381: 18.34,14.19 R40.2
SW_CAN_LOAD
  Top 0.305: R21.1 T1.1 | J5.12 28.56,7.61 29.35,8.4 R21.1 | R21.1
SW_CAN_MODE0
  Top 0.254: U10.2 36.72,11.87 36.25,11.4 36.25,10.11 J5.10
SW_CAN_MODE1
  Top 0.254: U10.3 36.28,13.13 35.76,12.61 35.76,10.29 34.24,8.77 33.11,8.77 31.84,7.5 J5.11
  Top 0.305: 37.44,13.13 U10.3
SW_CAN_RX
  Top 0.254: 38.72,11.26 38.72,10.85 | 38.72,10.85 J5.8 | 38.72,11.26 38.72,11.75 | 38.72,11.75 38.72,14.13 38.45,14.4 U10.4 | 39.03,11.2 R12.1 | 39.03,11.2 38.77,11.2 38.72,11.26 | 38.72,11.75 38.72,11.51 39.03,11.2 | 38.72,10.85 38.72,10.89 39.03,11.2
SW_CAN_TX
  Top 0.254: U10.1 37.7,9.02 J5.9 36.15,7.47 R46.1
  Top 0.305: 37.68,10.57 U10.1
UART_RX
  Top 0.254: J5.1 55.5,8.49 55.5,9.45 54.7,10.25 51.1,10.25 50.7,10.65 CP1202N.18
UART_TX
  Top 0.254: J5.2 54.95,8.49 54.95,9.38 54.52,9.81 54.51,9.8 50.75,9.8 50.2,10.35 CP1202N.17
V_J1850  (via drill 0.38, 0.41)
  Top 0.381: U9.2 | R44.2 12.25,35 T9.2 11.47,33.92 11.1,34.3 11.1,40.9 v11.05,40.95 | v9.3,49.25 v9.3,43.85
  Top 0.406: U9.2 60.75,46.2 60.15,46.8 R10.2
  Top 1.225: U9.2 U9.4
  Bottom 0.381: v66.05,48.8 65.95,48.8 65.35,49.4 9.45,49.4 v9.3,49.25 | v11.05,40.95 11.05,42.1 v9.3,43.85
  other vias: 66.05,47.07 66.05,45.33 66.05,43.6
  pour Bottom (isolate 0.305): 69.45,49.65 65.25,49.65 65.25,42.95 69.45,42.95
  pour Top (isolate 0.305, no thermals): 69.45,49.85 65.25,49.85 65.25,42.95 69.45,42.95
VBUS
  Top 0.254: CP1202N.8 51.2,20.1 51.2,20.17 | 51.2,20.17 51.2,20.3 | 51.2,20.3 51.2,20.43 | 51.33,20.3 51.52,20.3 51.7,20.12 CP1202N.7 | 51.33,20.3 51.2,20.3 | 51.2,20.43 51.2,20.55 50.9,20.85 50.9,23.15 51.15,23.4 C2.1 | 51.2,20.43 51.33,20.3 | 51.2,20.17 51.33,20.3
  Top 0.406: C2.1 C3.1 52.68,25.2 53.15,25.67 53.15,29.45 53.65,29.95 55.08,29.95 D21.2 55.1,31.34 55.41,31.65 59.06,31.65 59.4,31.31 59.4,26.27 J3.VBUS
VDD_CP  (via drill 0.38)
  Top 0.254: R9.2 R8.2 58.65,16.75 57.85,17.55 v54.7,17.55
  Top 0.305: R6.1 52.65,21.6 52.8,21.75 52.8,23.05 53.15,23.4 C4.1 54.45,23.4 54.7,23.15 v54.7,19.65
  Top 0.381: C4.1 C8.1 53.8,19.85 53.42,19.47 CP1202N.6
  Bottom 0.305: v54.7,19.65 v54.7,17.55
VPW_RX
  Top 0.305: IC2.2 38.2,38.95 38.72,39.47 J6.8 38.7,42.52 38.7,43.75 38.4,44.05 37.85,44.05 37.54,44.36 R27.1

### Text on the board
tPlace: +12V | 5V | 3.3V | UART TX | UART RX
tNames: DESIGNER: PIOTR MAZIARZ | EMAIL: PIOTR.MAZIARZ@GMAIL.COM | LICENSE: CREATIVE COMMONS / ATTRIBUTION 4.0
bNames: DESIGNER: PIOTR MAZIARZ | EMAIL: PIOTR.MAZIARZ@GMAIL.COM | LICENSE: CREATIVE COMMONS / ATTRIBUTION 4.0